# EAGLE schematic processor (EAGLE 9.0.0)

## Sheet 1 of 2
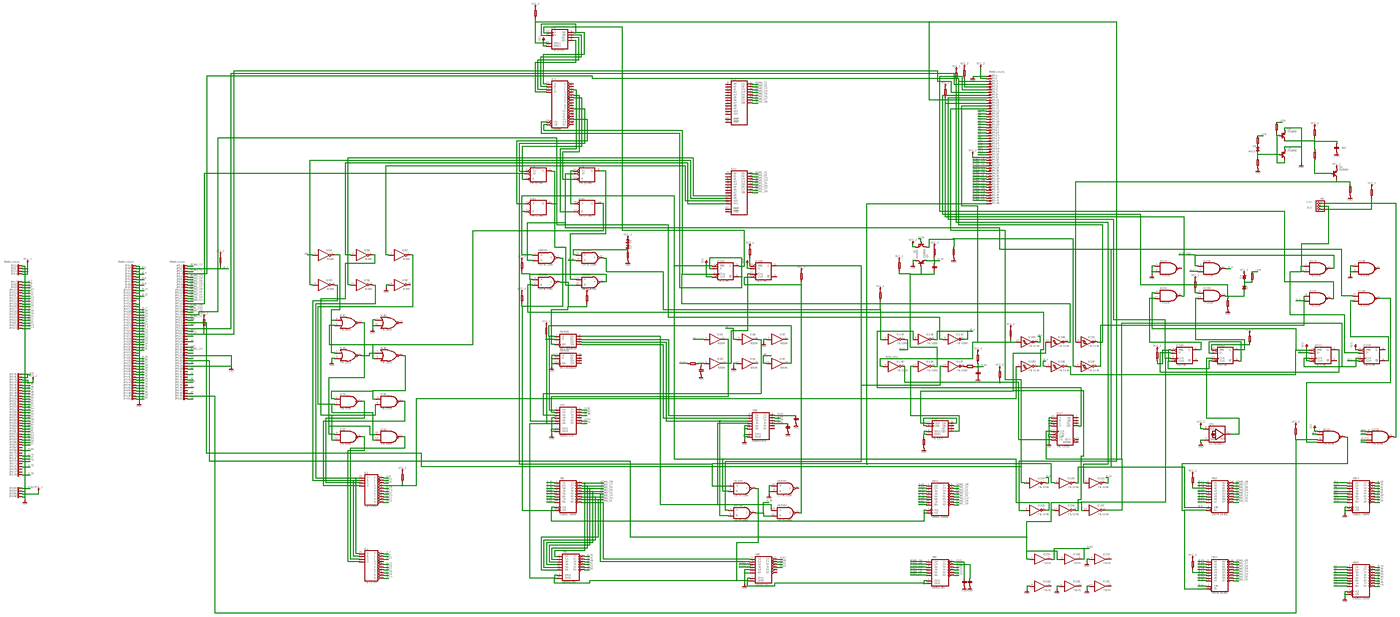
[diagram p0: schematic, sheet 1, overview]
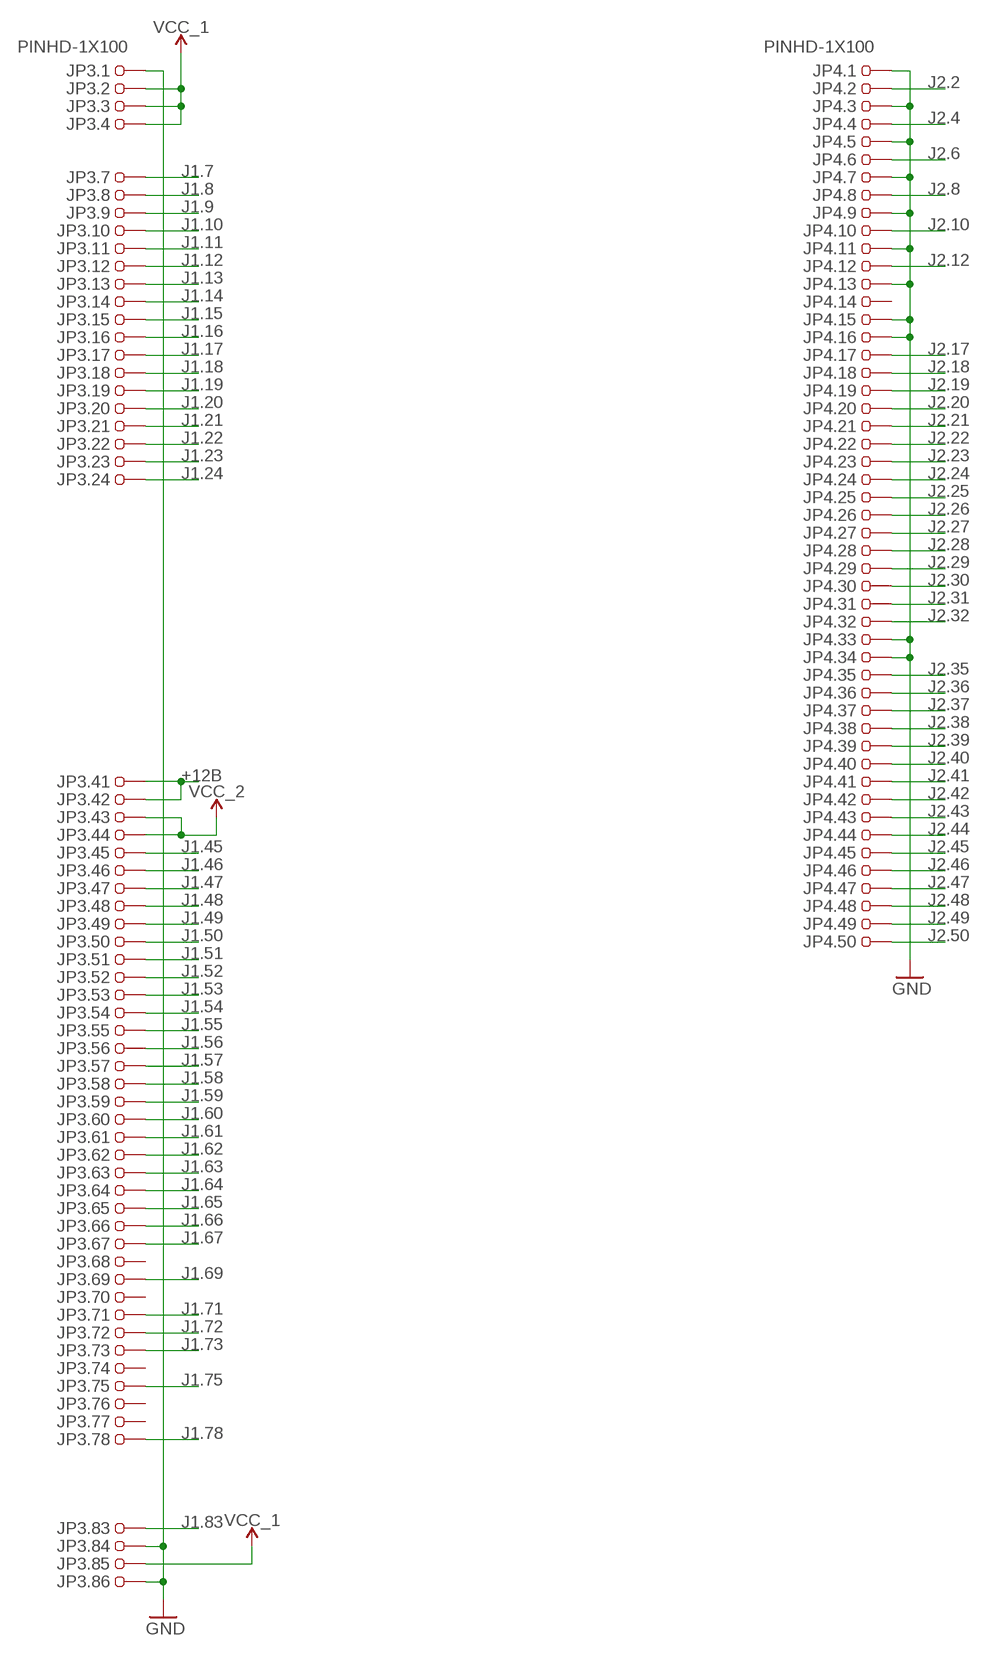
[diagram p1: schematic, sheet 1, part 1 of 6]
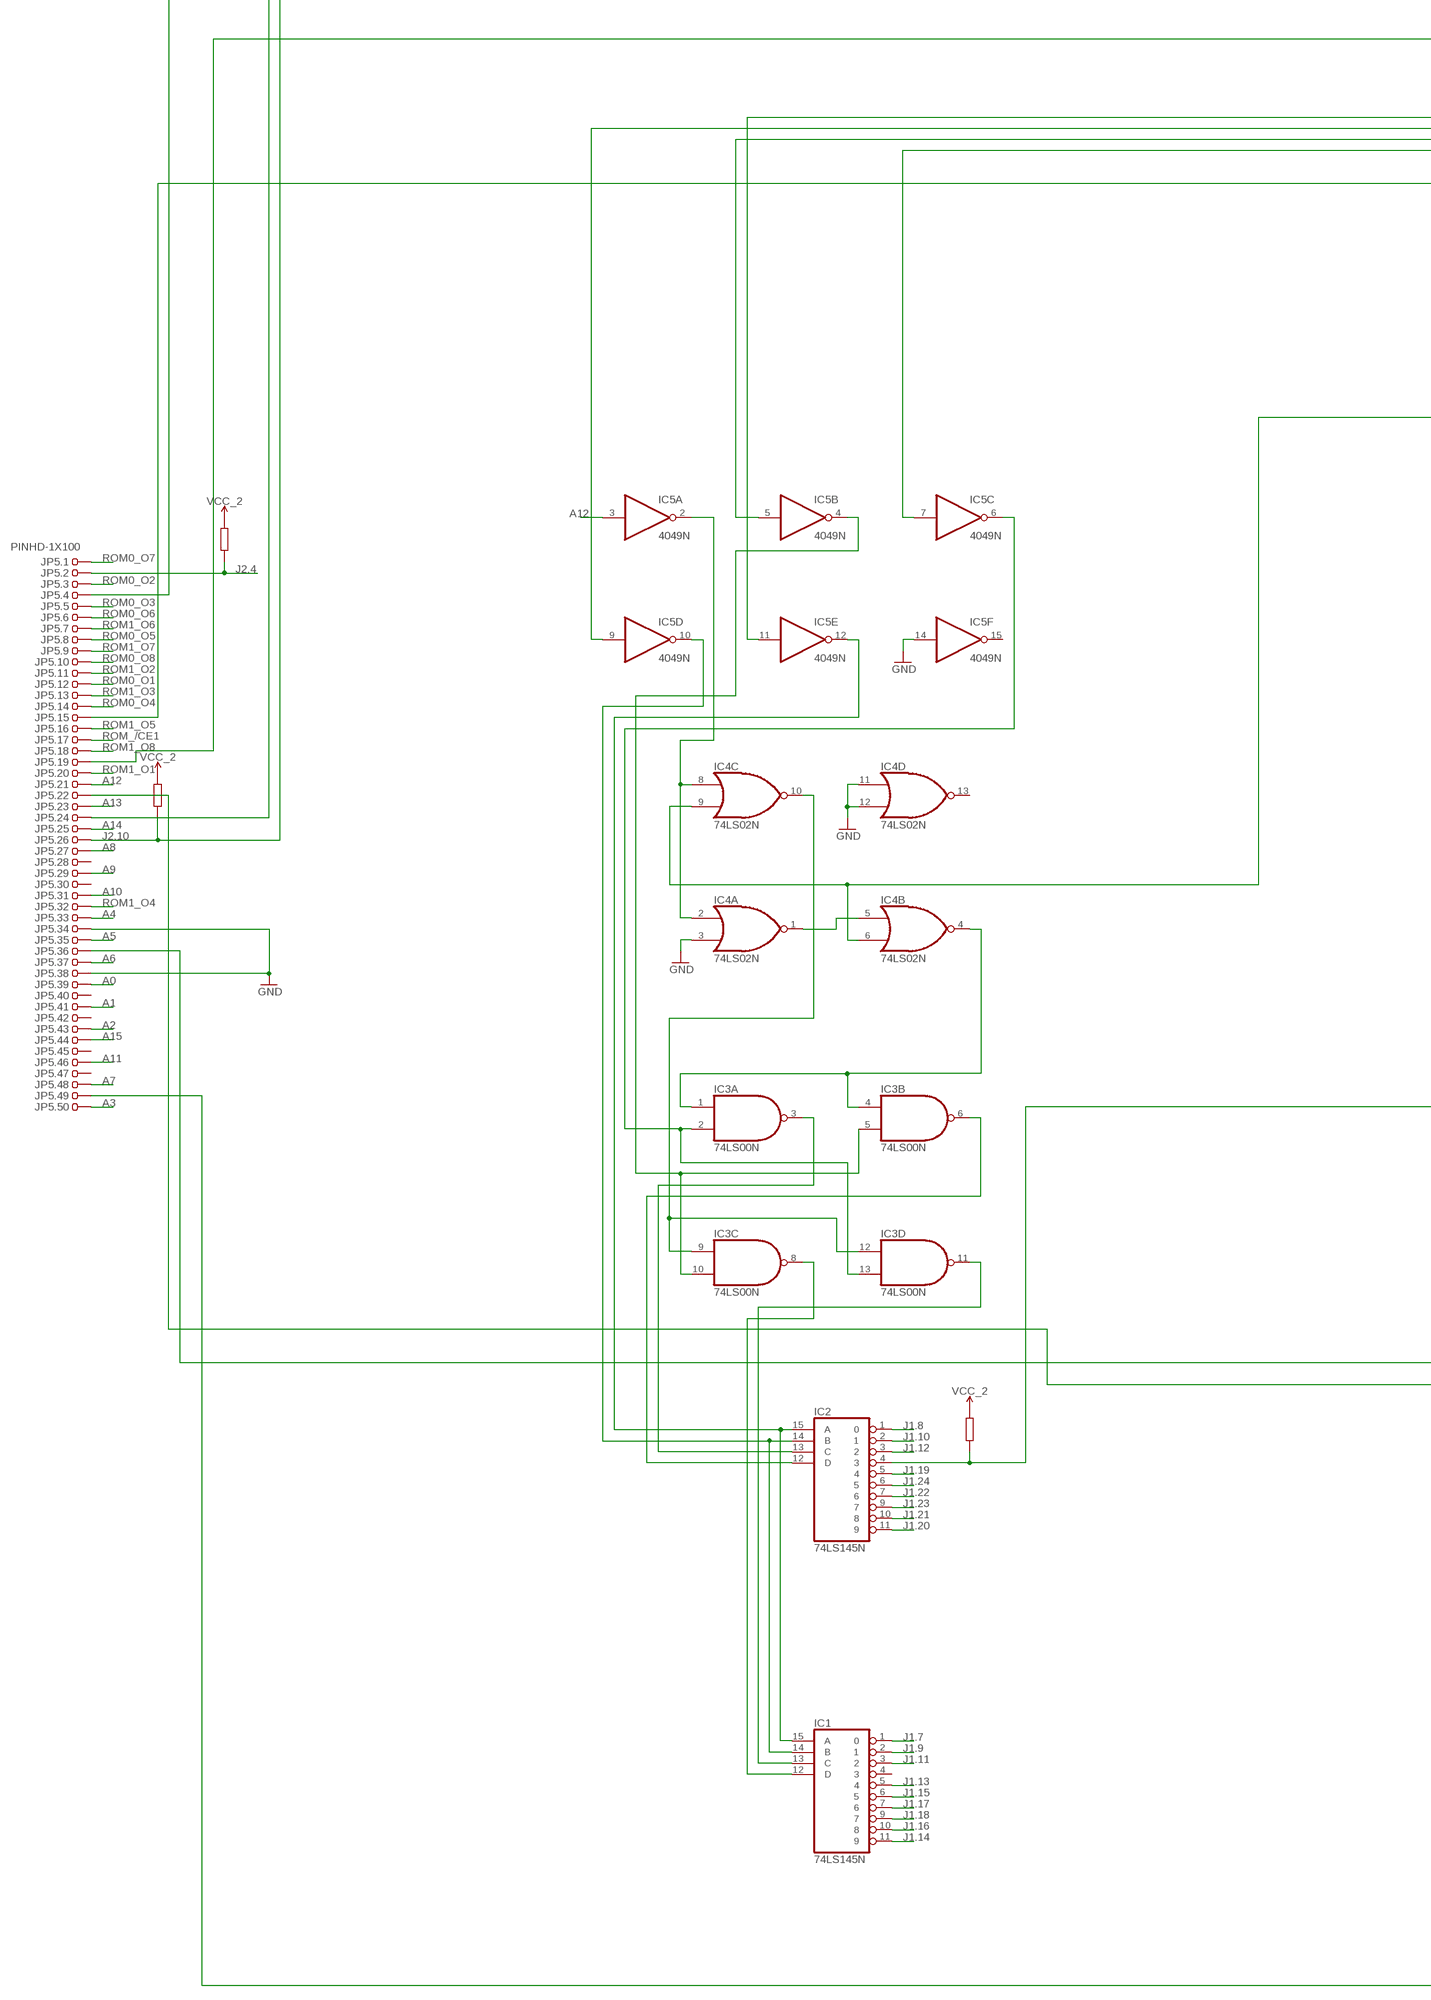
[diagram p2: schematic, sheet 1, part 2 of 6]
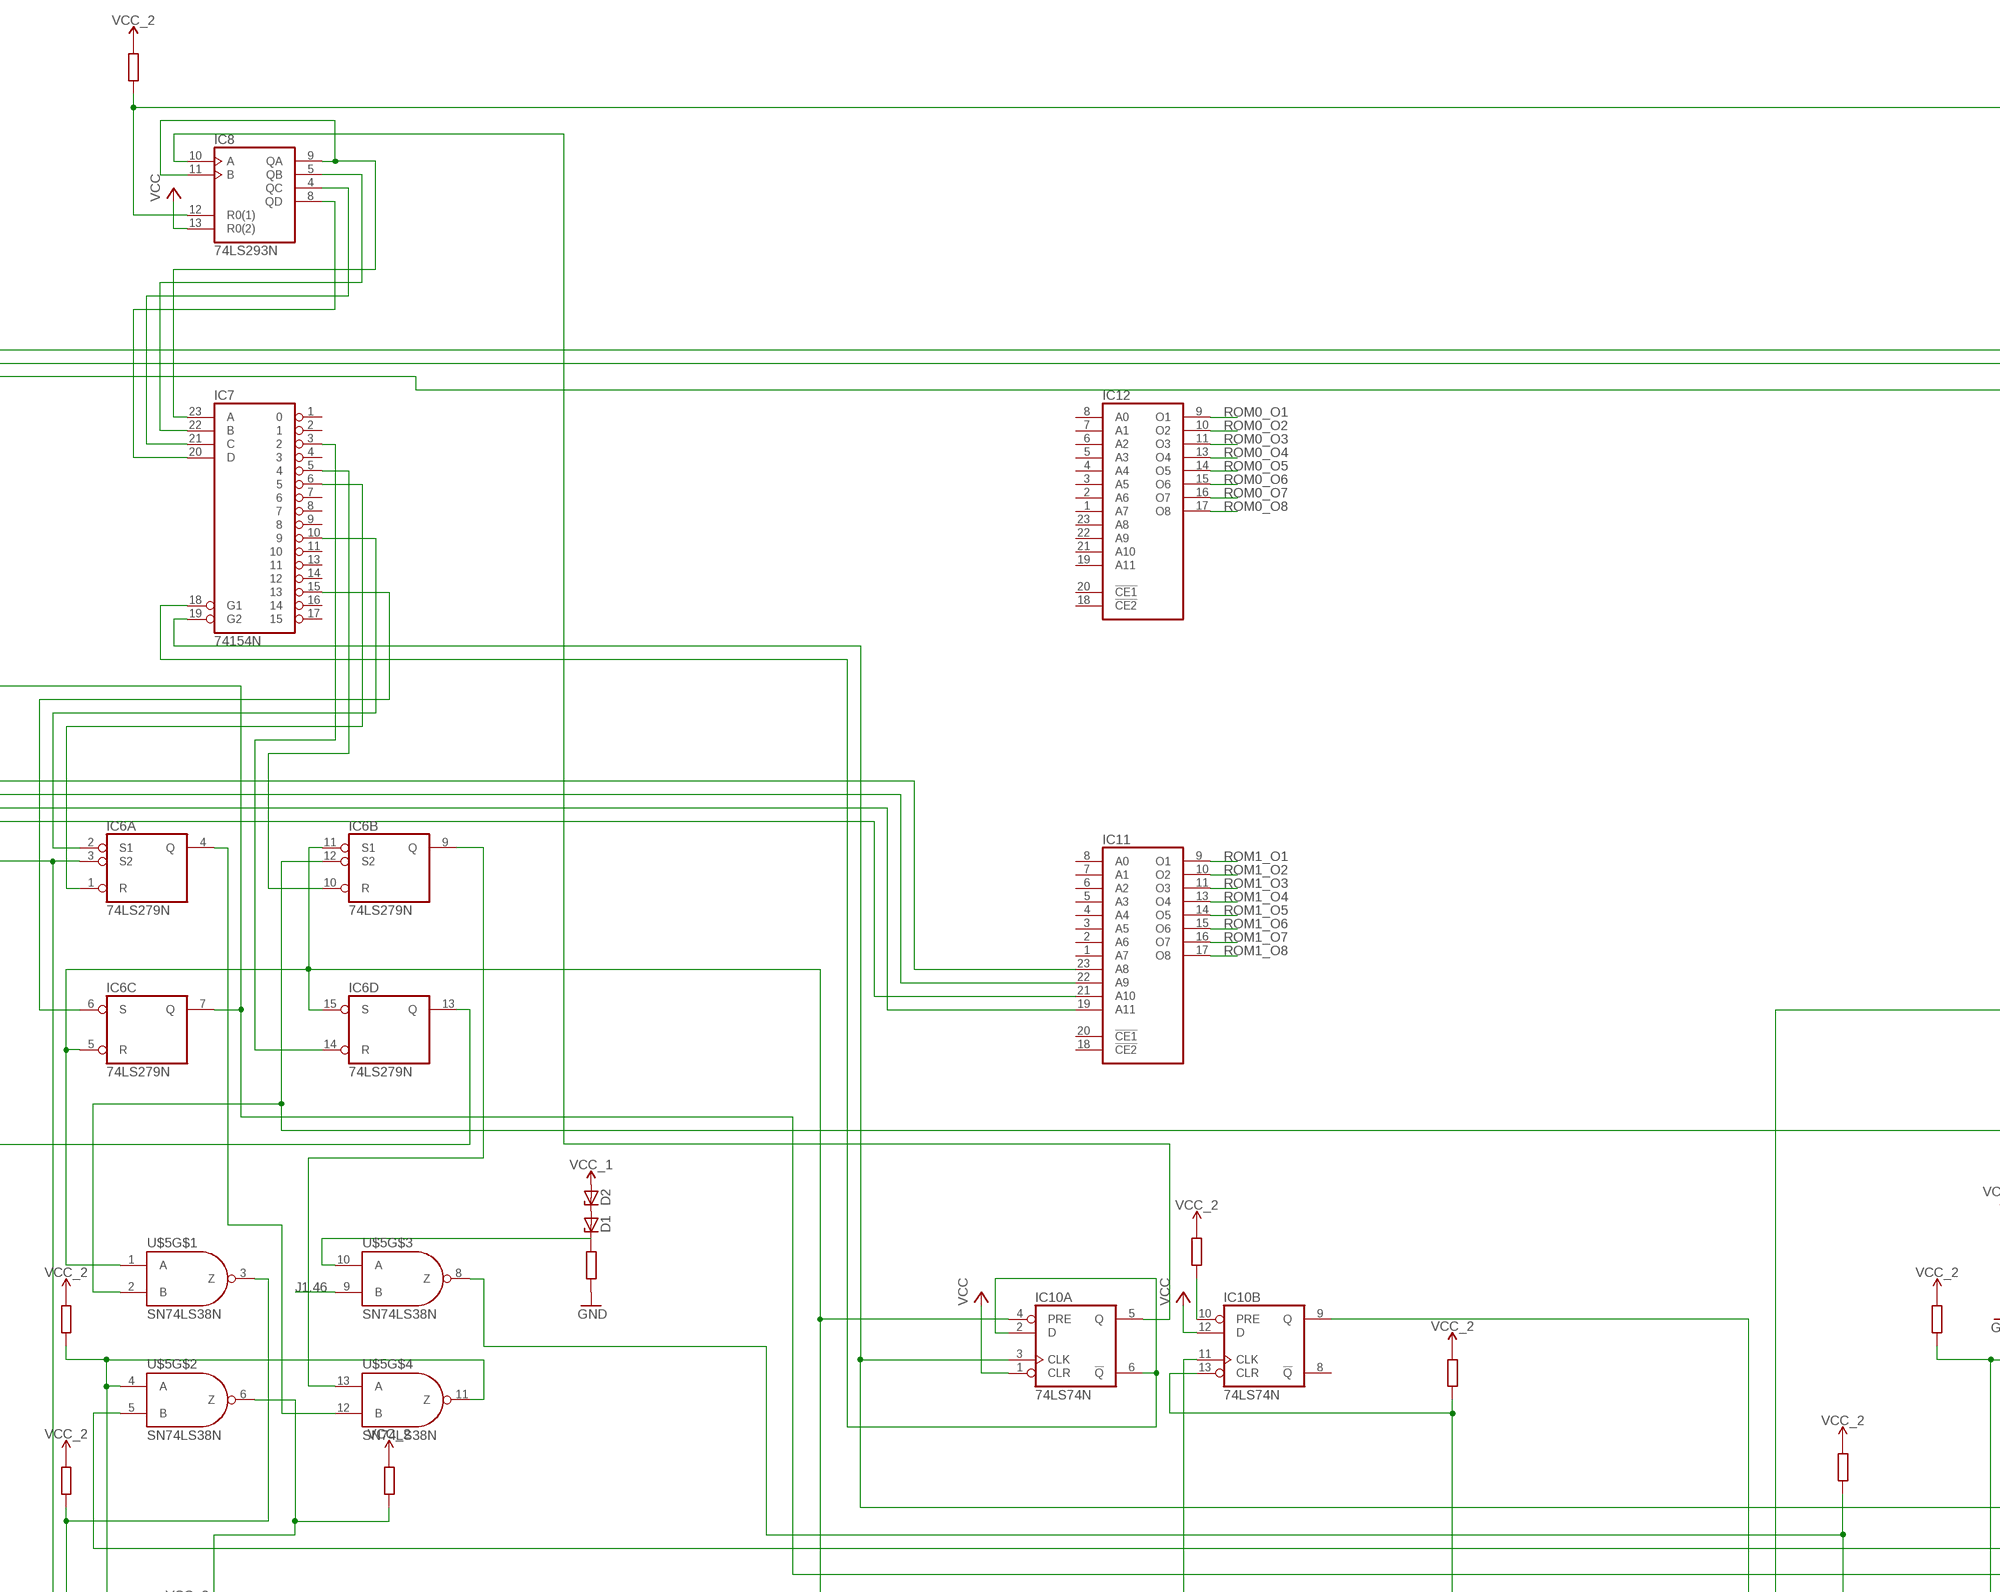
[diagram p3: schematic, sheet 1, part 3 of 6]
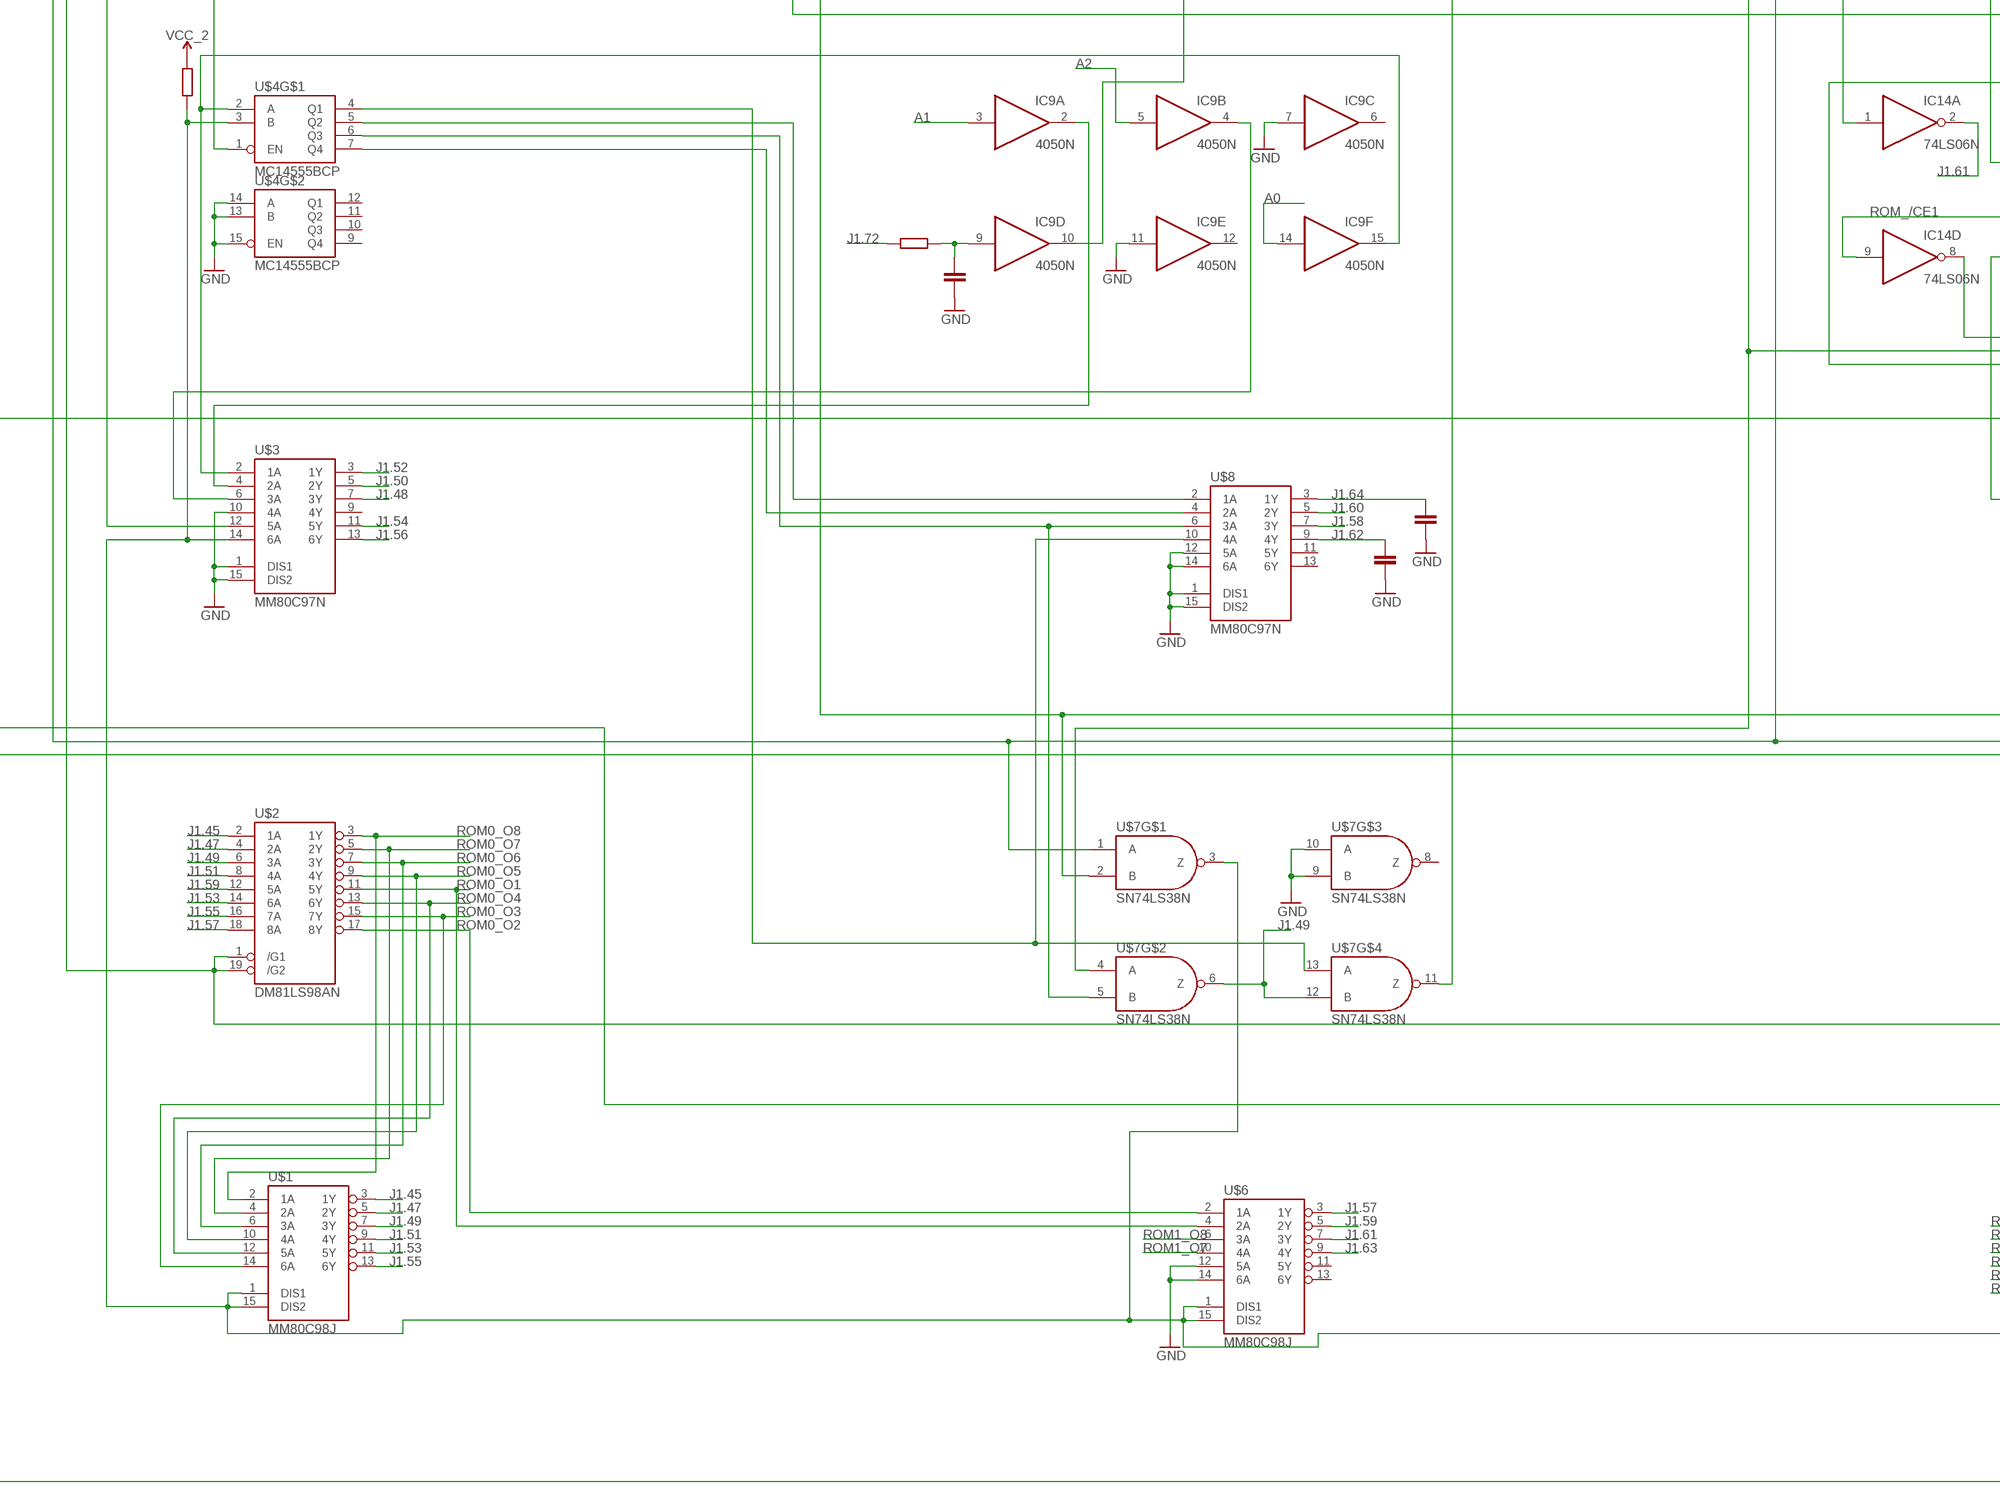
[diagram p4: schematic, sheet 1, part 4 of 6]
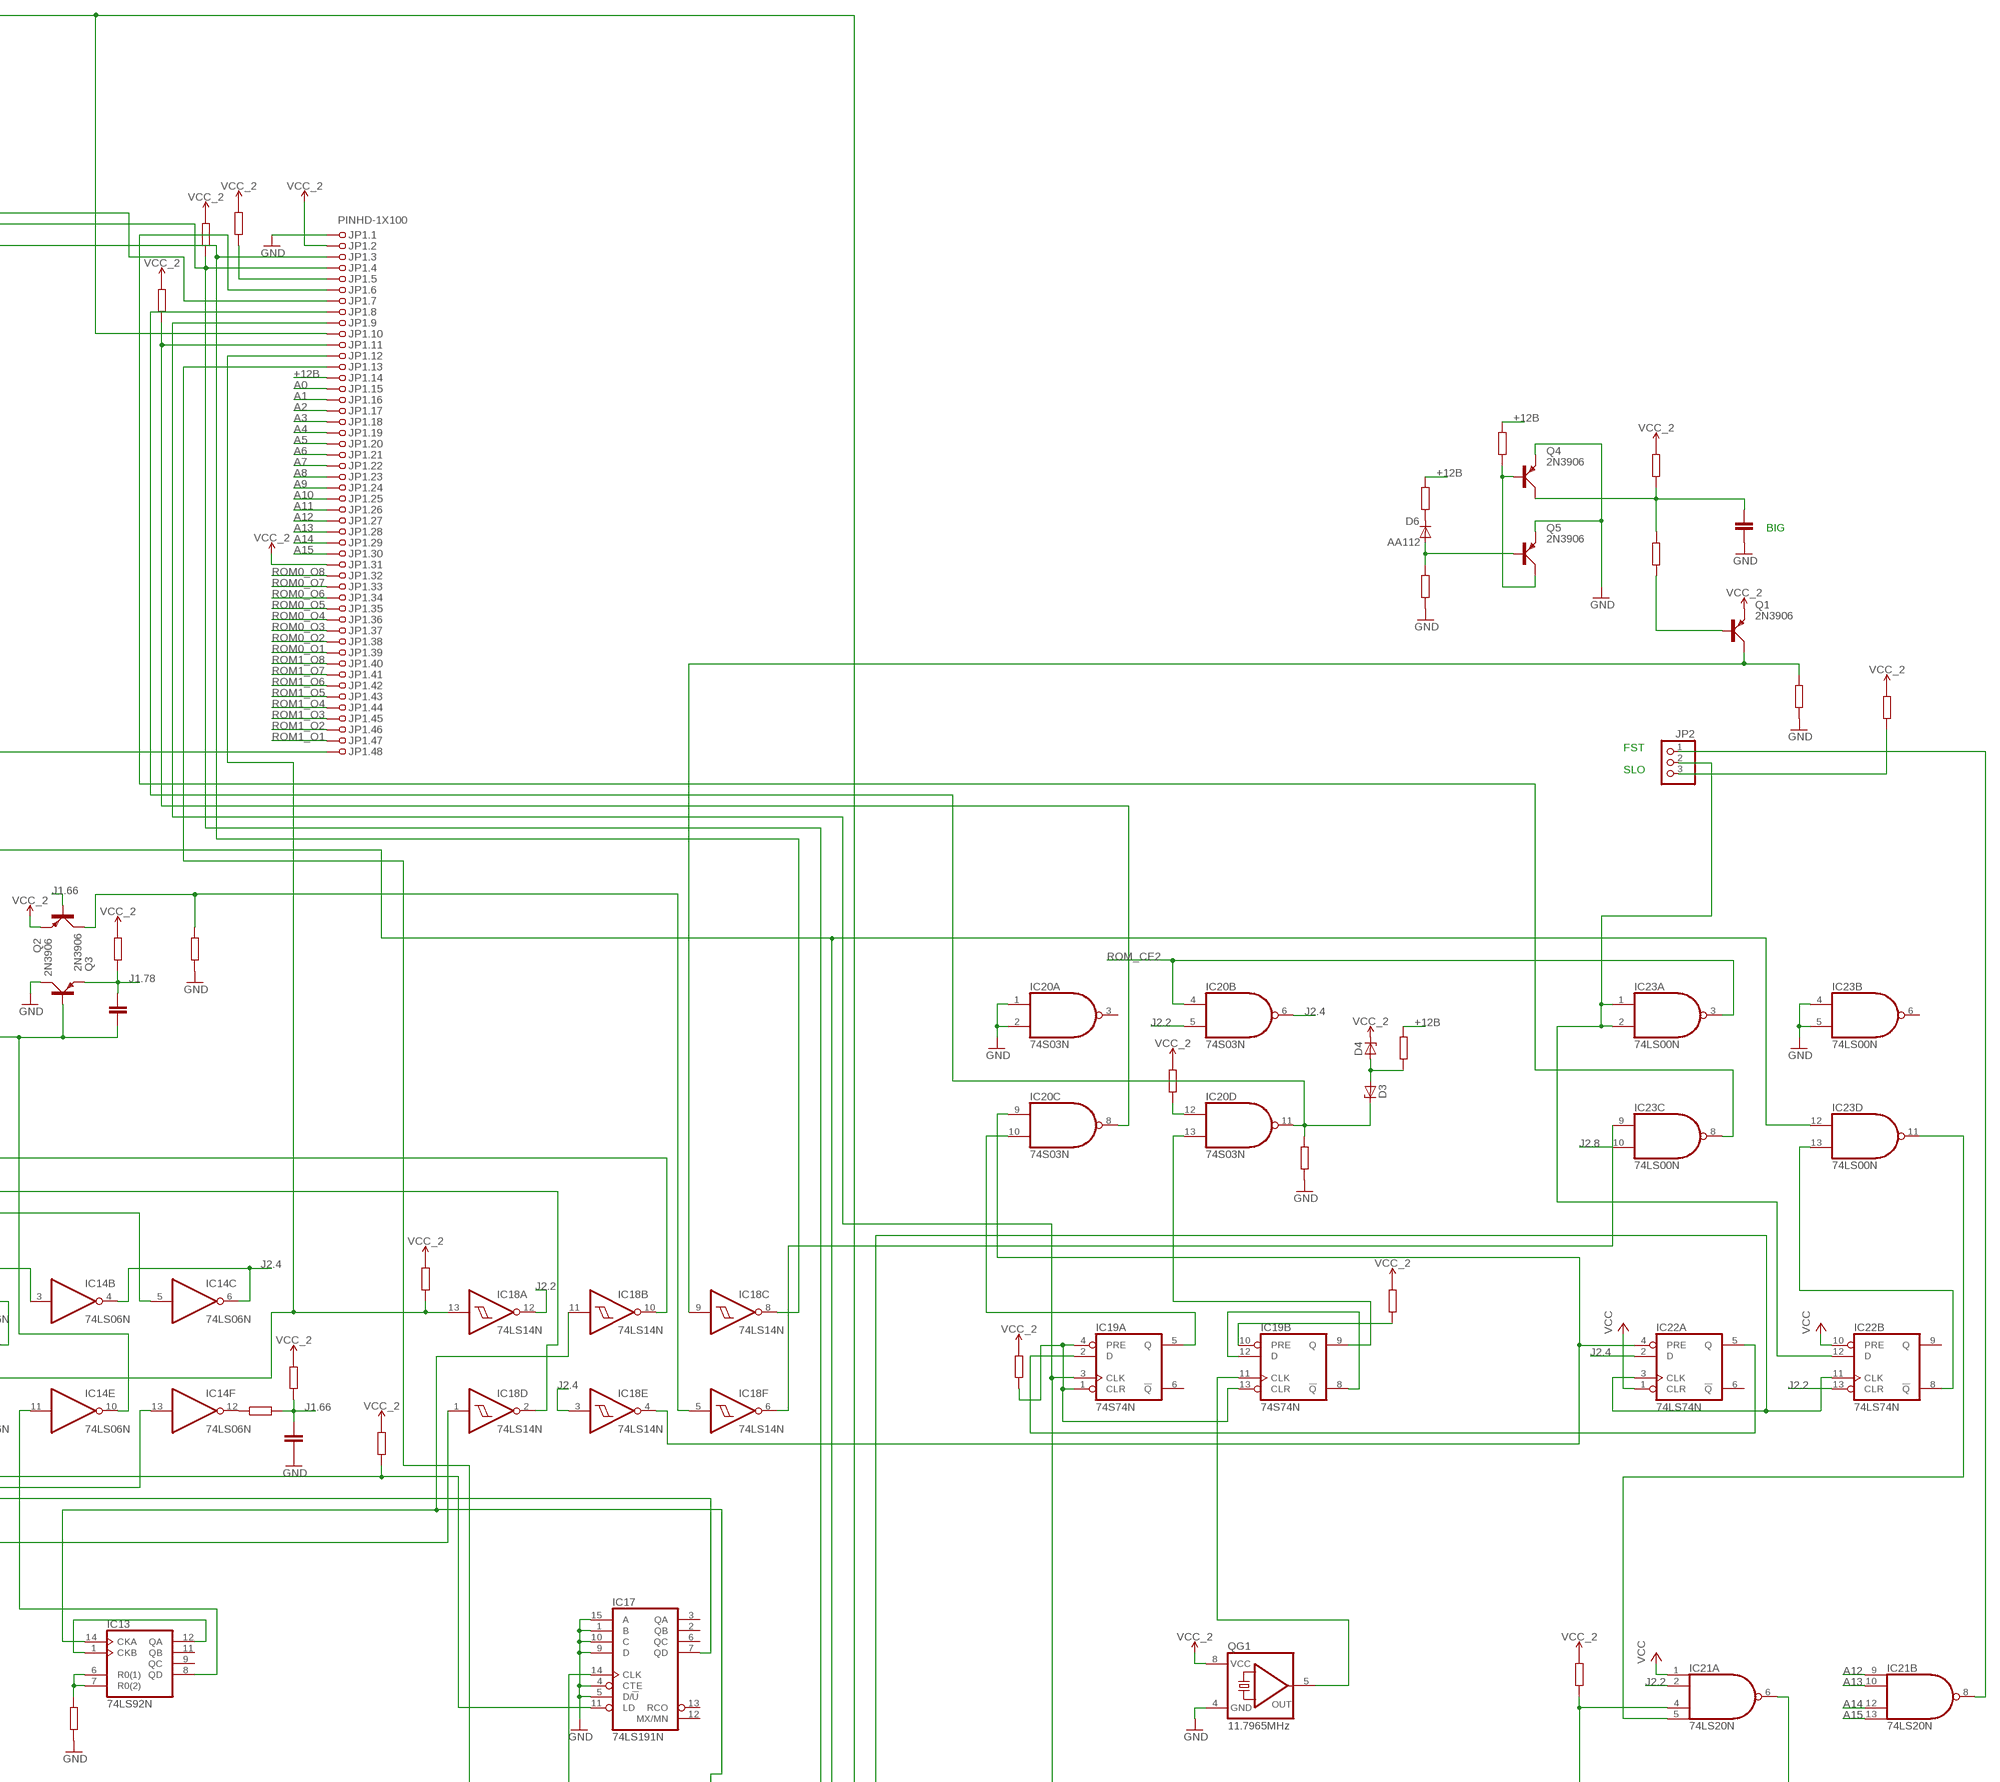
[diagram p5: schematic, sheet 1, part 5 of 6]
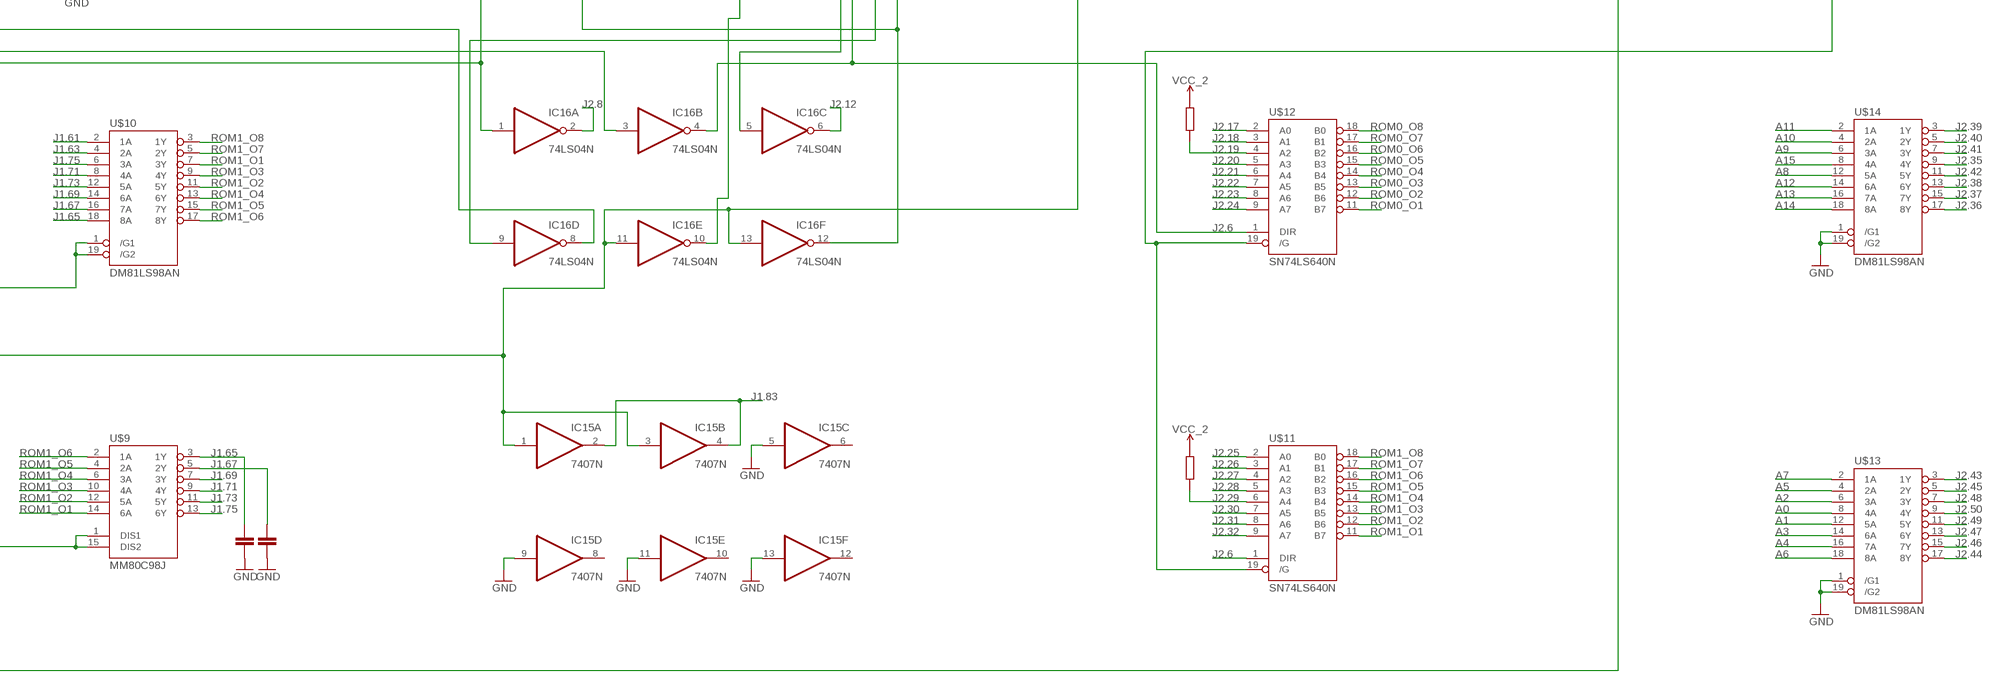
[diagram p6: schematic, sheet 1, part 6 of 6]

### Parts
D1  ZENER-DIODEC1702-15  [C1702-15]
D2  ZENER-DIODEC1702-15  [C1702-15]
D3  ZENER-DIODEC1702-15  [C1702-15]
D4  ZENER-DIODEC1702-15  [C1702-15]
D6  AA112  [DO07]
IC1  74LS145N  [DIL16]
IC2  74LS145N  [DIL16]
IC3  74LS00N  [DIL14]
IC4  74LS02N  [DIL14]
IC5  4049N  [DIL16]
IC6  74LS279N  [DIL16]
IC7  74154N  [DIL24-6]
IC8  74LS293N  [DIL14]
IC9  4050N  [DIL16]
IC10  74LS74N  [DIL14]
IC11  7142E  [DIL24]
IC12  7142E  [DIL24]
IC13  74LS92N  [DIL14]
IC14  74LS06N  [DIL14]
IC15  7407N  [DIL14]
IC16  74LS04N  [DIL14]
IC17  74LS191N  [DIL16]
IC18  74LS14N  [DIL14]
IC19  74S74N  [DIL14]
IC20  74S03N  [DIL14]
IC21  74LS20N  [DIL14]
IC22  74LS74N  [DIL14]
IC23  74LS00N  [DIL14]
JP1  PINHD-1X100  [1X100]
JP2  PINHD-1X3  [1X03]
JP3  PINHD-1X100  [1X100]
JP4  PINHD-1X100  [1X100]
JP5  PINHD-1X100  [1X100]
Q1  2N3906  [TO92D]
Q2  2N3906  [TO92D]
Q3  2N3906  [TO92D]
Q4  2N3906  [TO92D]
Q5  2N3906  [TO92D]
QG1  11.7965MHz  QG5460  [DIL08S]
U$1  MM80C98J  [DIL16]
U$2  DM81LS98AN  [DIL20]
U$3  MM80C97N  [DIL16]
U$4  MC14555BCP  [DIL16]
U$5  SN74LS38N  [DIL14]
U$6  MM80C98J  [DIL16]
U$7  SN74LS38N  [DIL14]
U$8  MM80C97N  [DIL16]
U$9  MM80C98J  [DIL16]
U$10  DM81LS98AN  [DIL20]
U$11  SN74LS640N  [DIL20]
U$12  SN74LS640N  [DIL20]
U$13  DM81LS98AN  [DIL20]
U$14  DM81LS98AN  [DIL20]

### Nets
+12B: D3.A D4.A JP1.14 JP3.41 JP3.42 ; also sheet 2
A0: IC9.14(F:I) JP1.15 JP5.39 U$13.8(4A) ; also sheet 2
A1: IC9.3(A:I) JP1.16 JP5.41 U$13.12(5A) ; also sheet 2
A2: IC9.5(B:I) JP1.17 JP5.43 U$13.6(3A) ; also sheet 2
A3: JP1.18 JP5.50 U$13.14(6A) ; also sheet 2
A4: JP1.19 JP5.33 U$13.16(7A) ; also sheet 2
A5: JP1.20 JP5.35 U$13.4(2A) ; also sheet 2
A6: JP1.21 JP5.37 U$13.18(8A) ; also sheet 2
A7: JP1.22 JP5.48 U$13.2(1A) ; also sheet 2
A8: JP1.23 JP5.27 U$14.12(5A) ; also sheet 2
A9: JP1.24 JP5.29 U$14.6(3A) ; also sheet 2
A10: JP1.25 JP5.31 U$14.4(2A) ; also sheet 2
A11: JP1.26 JP5.46 U$14.2(1A) ; also sheet 2
A12: IC5.3(A:I) IC21.9(B:I0) JP1.27 JP5.21 U$14.14(6A) ; also sheet 2
A13: IC21.10(B:I1) JP1.28 JP5.23 U$14.16(7A) ; also sheet 2
A14: IC21.12(B:I2) JP1.29 JP5.25 U$14.18(8A) ; also sheet 2
A15: IC21.13(B:I3) JP1.30 JP5.44 U$14.8(4A) ; also sheet 2
GND: IC4.3(A:I1) IC4.11(D:I0) IC4.12(D:I1) IC5.14(F:I) IC9.7(C:I) IC9.11(E:I) IC15.5(C:I) IC15.9(D:I) IC15.11(E:I) IC15.13(F:I) IC17.1(B) IC17.4(CTE) IC17.5(D/!U) IC17.9(D) IC17.10(C) IC17.15(A) IC20.1(A:I0) IC20.2(A:I1) IC23.4(B:I0) IC23.5(B:I1) JP1.1 JP3.1 JP3.84 JP3.86 JP4.1 JP4.3 JP4.5 JP4.7 JP4.9 JP4.11 JP4.13 JP4.15 JP4.16 JP4.33 JP4.34 JP5.34 JP5.38 Q3.C Q4.E Q5.E QG1.4(GND) U$3.1(DIS1) U$3.10(4A) U$3.15(DIS2) U$4.13(B) U$4.14(A) U$4.15(EN) U$6.12(5A) U$6.14(6A) U$7.9(B) U$7.10(A) U$8.1(DIS1) U$8.12(5A) U$8.14(6A) U$8.15(DIS2) U$13.1(/G1) U$13.19(/G2) U$14.1(/G1) U$14.19(/G2) ; also sheet 2
J1.7: IC1.1 JP3.7
J1.8: IC2.1 JP3.8
J1.9: IC1.2 JP3.9
J1.10: IC2.2 JP3.10
J1.11: IC1.3 JP3.11
J1.12: IC2.3 JP3.12
J1.13: IC1.5 JP3.13
J1.14: IC1.11 JP3.14
J1.15: IC1.6 JP3.15
J1.16: IC1.10 JP3.16
J1.17: IC1.7 JP3.17
J1.18: IC1.9 JP3.18
J1.19: IC2.5 JP3.19
J1.20: IC2.11 JP3.20
J1.21: IC2.10 JP3.21
J1.22: IC2.7 JP3.22
J1.23: IC2.9 JP3.23
J1.24: IC2.6 JP3.24
J1.45: JP3.45 U$1.3(1Y) U$2.2(1A)
J1.46: JP3.46 U$5.9(B) ; also sheet 2
J1.47: JP3.47 U$1.5(2Y) U$2.4(2A)
J1.48: JP3.48 U$3.7(3Y)
J1.49: JP3.49 U$1.7(3Y) U$2.6(3A) U$7.6(Z) U$7.12(B)
J1.50: JP3.50 U$3.5(2Y)
J1.51: JP3.51 U$1.9(4Y) U$2.8(4A)
J1.52: JP3.52 U$3.3(1Y)
J1.53: JP3.53 U$1.11(5Y) U$2.14(6A)
J1.54: JP3.54 U$3.11(5Y)
J1.55: JP3.55 U$1.13(6Y) U$2.16(7A)
J1.56: JP3.56 U$3.13(6Y)
J1.57: JP3.57 U$2.18(8A) U$6.3(1Y)
J1.58: JP3.58 U$8.7(3Y)
J1.59: JP3.59 U$2.12(5A) U$6.5(2Y)
J1.60: JP3.60 U$8.5(2Y)
J1.61: IC14.2(A:O) JP3.61 U$6.7(3Y) U$10.2(1A)
J1.62: JP3.62 U$8.9(4Y)
J1.63: JP3.63 U$6.9(4Y) U$10.4(2A)
J1.64: JP3.64 U$8.3(1Y)
J1.65: JP3.65 U$9.3(1Y) U$10.18(8A)
J1.66: JP3.66 Q2.B
J1.67: JP3.67 U$9.5(2Y) U$10.16(7A)
J1.69: JP3.69 U$9.7(3Y) U$10.14(6A)
J1.71: JP3.71 U$9.9(4Y) U$10.8(4A)
J1.72: JP3.72 ; also sheet 2
J1.73: JP3.73 U$9.11(5Y) U$10.12(5A)
J1.75: JP3.75 U$9.13(6Y) U$10.6(3A)
J1.78: JP3.78 Q3.E ; also sheet 2
J1.83: IC15.2(A:O) IC15.4(B:O) JP3.83
J2.2: IC18.12(A:O) IC20.5(B:I1) IC21.2(A:I1) IC22.13(B:CLR) JP4.2
J2.4: IC14.4(B:O) IC14.6(C:O) IC18.3(E:I) IC20.6(B:O) IC22.2(A:D) JP4.4 JP5.2
J2.6: IC6.12(B:S2) IC16.4(B:O) IC23.12(D:I0) JP4.6 U$5.2(B) U$11.1(DIR) U$12.1(DIR)
J2.8: IC16.2(A:O) IC23.10(C:I1) JP4.8
J2.10: JP1.7 JP4.10 JP5.26
J2.12: IC16.6(C:O) JP4.12 ; also sheet 2
J2.17: JP4.17 U$12.2(A0)
J2.18: JP4.18 U$12.3(A1)
J2.19: JP4.19 U$12.4(A2)
J2.20: JP4.20 U$12.5(A3)
J2.21: JP4.21 U$12.6(A4)
J2.22: JP4.22 U$12.7(A5)
J2.23: JP4.23 U$12.8(A6)
J2.24: JP4.24 U$12.9(A7)
J2.25: JP4.25 U$11.2(A0)
J2.26: JP4.26 U$11.3(A1)
J2.27: JP4.27 U$11.4(A2)
J2.28: JP4.28 U$11.5(A3)
J2.29: JP4.29 U$11.6(A4)
J2.30: JP4.30 U$11.7(A5)
J2.31: JP4.31 U$11.8(A6)
J2.32: JP4.32 U$11.9(A7)
J2.35: JP4.35 U$14.9(4Y)
J2.36: JP4.36 U$14.17(8Y)
J2.37: JP4.37 U$14.15(7Y)
J2.38: JP4.38 U$14.13(6Y)
J2.39: JP4.39 U$14.3(1Y)
J2.40: JP4.40 U$14.5(2Y)
J2.41: JP4.41 U$14.7(3Y)
J2.42: JP4.42 U$14.11(5Y)
J2.43: JP4.43 U$13.3(1Y)
J2.44: JP4.44 U$13.17(8Y)
J2.45: JP4.45 U$13.5(2Y)
J2.46: JP4.46 U$13.15(7Y)
J2.47: JP4.47 U$13.13(6Y)
J2.48: JP4.48 U$13.7(3Y)
J2.49: JP4.49 U$13.11(5Y)
J2.50: JP4.50 U$13.9(4Y)
N$1: IC3.1(A:I0) IC3.4(B:I0) IC4.4(B:O)
N$2: IC3.2(A:I1) IC3.13(D:I1) IC5.6(C:O)
N$3: IC3.5(B:I1) IC3.10(C:I1) IC5.4(B:O)
N$4: IC3.9(C:I0) IC3.12(D:I0) IC4.10(C:O)
N$5: IC4.1(A:O) IC4.5(B:I0)
N$6: IC4.2(A:I0) IC4.8(C:I0) IC5.2(A:O)
N$7: IC10.10(B:PRE)
N$8: IC9.10(D:O) IC10.11(B:CLK)
N$9: IC4.6(B:I1) IC4.9(C:I1) IC6.13(D:Q)
N$10: U$3.12(5A) U$5.4(A) U$5.11(Z)
N$11: IC6.5(C:R) IC6.11(B:S1) IC6.15(D:S) IC10.4(A:PRE) IC16.8(D:O) U$5.1(A) U$7.2(B)
N$12: IC10.13(B:CLR) U$7.11(Z)
N$13: IC7.23(A) IC8.9(QA) IC8.11(B)
N$14: IC18.5(F:I) Q2.C
N$15: IC14.3(B:I) IC17.7(QD)
N$16: U$2.1(/G1) U$2.19(/G2) U$5.3(Z) U$10.1(/G1) U$10.19(/G2)
N$17: IC19.1(A:CLR) IC19.4(A:PRE) IC19.13(B:CLR)
N$18: IC1.15(A) IC2.15(A) IC5.12(E:O)
N$20: IC1.14(B) IC2.14(B) IC5.10(D:O)
N$21: IC22.12(B:D) IC23.1(A:I0) IC23.2(A:I1) JP2.2
N$22: IC19.8(B:!Q) IC19.12(B:D)
N$23: IC9.9(D:I)
N$24: IC14.10(E:O) Q3.B
N$25: IC20.8(C:O) JP1.11
N$26: IC1.13(C) IC3.11(D:O)
N$27: IC1.12(D) IC3.8(C:O)
N$28: IC2.13(C) IC3.3(A:O)
N$29: IC2.12(D) IC3.6(B:O)
N$31: IC2.4 IC18.1(D:I)
N$32: IC5.5(B:I) IC11.19(A11)
N$33: IC5.7(C:I) IC11.21(A10)
N$34: IC7.21(C) IC8.4(QC)
N$35: IC5.11(E:I) IC11.23(A8)
N$36: IC5.9(D:I) IC11.22(A9)
N$38: IC7.22(B) IC8.5(QB)
N$39: IC7.20(D) IC8.8(QD)
N$40: IC8.12(R0(1)) IC16.9(D:I) JP1.10
N$41: IC7.19(G2) IC10.3(A:CLK) IC18.10(B:O)
N$42: IC8.10(A) IC10.5(A:Q)
N$43: IC6.14(D:R) IC7.3
N$44: IC6.10(B:R) IC7.5
N$45: IC6.1(A:R) IC7.6
N$46: IC6.2(A:S1) IC7.10
N$47: IC6.6(C:S) IC7.15
N$48: IC6.4(A:Q) U$5.12(B)
N$49: IC7.18(G1) IC10.2(A:D) IC10.6(A:!Q)
N$50: IC6.3(A:S2) IC16.3(B:I) JP1.48 JP5.15 U$7.1(A)
N$51: IC6.7(C:Q) IC14.5(C:I) JP5.19
N$52: D1.C U$5.10(A)
N$53: IC6.9(B:Q) U$5.13(A)
N$54: IC9.15(F:O) U$3.2(1A) U$4.2(A)
N$55: IC10.9(B:Q) IC14.13(F:I) U$7.4(A)
N$56: U$4.4(Q1) U$7.13(A) U$8.10(4A)
N$57: IC18.2(D:O) U$5.5(B)
N$58: U$4.1(EN) U$5.6(Z)
N$59: U$4.5(Q2) U$8.2(1A)
N$60: IC14.1(A:I) U$5.8(Z)
N$61: U$4.6(Q3) U$7.5(B) U$8.6(3A)
N$62: D1.A D2.C
N$63: U$4.7(Q4) U$8.4(2A)
N$64: IC9.2(A:O) U$3.4(2A)
N$65: IC9.4(B:O) U$3.6(3A)
N$66: IC14.8(D:O) IC17.11(LD)
N$67: U$1.1(DIS1) U$1.15(DIS2) U$3.14(6A) U$4.3(B) U$6.1(DIS1) U$6.15(DIS2) U$7.3(Z) U$9.1(DIS1) U$9.15(DIS2)
N$69: IC13.8(QD) IC14.11(E:I)
N$70: IC13.6(R0(1)) IC13.7(R0(2))
N$71: IC13.14(CKA) IC16.10(E:O) IC18.11(B:I)
N$72: IC18.4(E:O) IC20.9(C:I0) IC22.4(A:PRE)
N$73: IC13.1(CKB) IC13.12(QA)
N$74: IC18.8(C:O) JP1.3 JP5.4
N$75: IC18.6(F:O) IC23.9(C:I0)
N$76: IC18.9(C:I) Q1.C
N$77: IC16.5(C:I) JP1.4 JP5.24
N$78: IC16.12(F:O) IC17.14(CLK) IC22.3(A:CLK) IC22.11(B:CLK)
N$79: IC16.1(A:I) JP1.13 JP5.22
N$80: D3.C IC20.11(D:O) JP1.8
N$81: IC20.12(D:I0)
N$82: IC19.5(A:Q) IC20.10(C:I1)
N$83: IC19.9(B:Q) IC20.13(D:I1)
N$84: IC21.6(A:O) U$11.19(/G) U$12.19(/G)
N$85: IC19.2(A:D) IC22.5(A:Q)
N$86: IC19.10(B:PRE)
N$87: IC19.11(B:CLK) QG1.5(OUT)
N$88: IC21.8(B:O) JP2.1
N$89: Q1.B
N$90: Q4.C
N$91: JP2.3
N$92: Q4.B Q5.C
N$94: D6.A Q5.B
N$96: IC23.8(C:O) JP1.6
N$97: IC22.8(B:!Q) IC23.13(D:I1)
N$98: JP1.5
N$99: IC21.4(A:I2) JP5.49
N$110: IC21.5(A:I3) IC23.11(D:O)
N$999: IC15.1(A:I) IC15.3(B:I) IC16.11(E:I) IC16.13(F:I) IC19.3(A:CLK) JP1.9 JP5.36
ROM0_O1: IC12.9(O1) JP1.39 JP5.12 U$2.11(5Y) U$6.4(2A) U$12.11(B7)
ROM0_O2: IC12.10(O2) JP1.38 JP5.3 U$2.17(8Y) U$6.2(1A) U$12.12(B6)
ROM0_O3: IC12.11(O3) JP1.37 JP5.5 U$1.14(6A) U$2.15(7Y) U$12.13(B5)
ROM0_O4: IC12.13(O4) JP1.36 JP5.14 U$1.12(5A) U$2.13(6Y) U$12.14(B4)
ROM0_O5: IC12.14(O5) JP1.35 JP5.8 U$1.10(4A) U$2.9(4Y) U$12.15(B3)
ROM0_O6: IC12.15(O6) JP1.34 JP5.6 U$1.6(3A) U$2.7(3Y) U$12.16(B2)
ROM0_O7: IC12.16(O7) JP1.33 JP5.1 U$1.4(2A) U$2.5(2Y) U$12.17(B1)
ROM0_O8: IC12.17(O8) JP1.32 JP5.10 U$1.2(1A) U$2.3(1Y) U$12.18(B0)
ROM1_O1: IC11.9(O1) JP1.47 JP5.20 U$9.14(6A) U$10.7(3Y) U$11.11(B7)
ROM1_O2: IC11.10(O2) JP1.46 JP5.11 U$9.12(5A) U$10.11(5Y) U$11.12(B6)
ROM1_O3: IC11.11(O3) JP1.45 JP5.13 U$9.10(4A) U$10.9(4Y) U$11.13(B5)
ROM1_O4: IC11.13(O4) JP1.44 JP5.32 U$9.6(3A) U$10.13(6Y) U$11.14(B4)
ROM1_O5: IC11.14(O5) JP1.43 JP5.16 U$9.4(2A) U$10.15(7Y) U$11.15(B3)
ROM1_O6: IC11.15(O6) JP1.42 JP5.7 U$9.2(1A) U$10.17(8Y) U$11.16(B2)
ROM1_O7: IC11.16(O7) JP1.41 JP5.9 U$6.10(4A) U$10.5(2Y) U$11.17(B1)
ROM1_O8: IC11.17(O8) JP1.40 JP5.18 U$6.6(3A) U$10.3(1Y) U$11.18(B0)
ROM_/CE1: IC14.9(D:I) IC18.13(A:I) JP1.12 JP5.17
ROM_CE2: IC20.4(B:I0) IC23.3(A:O) ; also sheet 2
VCC: IC8.13(R0(2)) IC10.1(A:CLR) IC10.12(B:D) IC21.1(A:I0) IC22.1(A:CLR) IC22.10(B:PRE) ; also sheet 2
VCC_1: D2.A JP3.2 JP3.3 JP3.4 JP3.85 ; also sheet 2
VCC_2: D4.C JP1.2 JP1.31 JP3.43 JP3.44 Q1.E Q2.E QG1.8(VCC) ; also sheet 2
Unconnected: D6.C IC1.4 IC4.13(D:O) IC5.15(F:O) IC7.1 IC7.2 IC7.4 IC7.7 IC7.8 IC7.9 IC7.11 IC7.13 IC7.14 IC7.16 IC7.17 IC9.6(C:O) IC9.12(E:O) IC10.8(B:!Q) IC11.1(A7) IC11.2(A6) IC11.3(A5) IC11.4(A4) IC11.5(A3) IC11.6(A2) IC11.7(A1) IC11.8(A0) IC11.18(!CE2) IC11.20(!CE1) IC12.1(A7) IC12.2(A6) IC12.3(A5) IC12.4(A4) IC12.5(A3) IC12.6(A2) IC12.7(A1) IC12.8(A0) IC12.18(!CE2) IC12.19(A11) IC12.20(!CE1) IC12.21(A10) IC12.22(A9) IC12.23(A8) IC13.9(QC) IC13.11(QB) IC14.12(F:O) IC15.6(C:O) IC15.8(D:O) IC15.10(E:O) IC15.12(F:O) IC17.2(QB) IC17.3(QA) IC17.6(QC) IC17.12(MX/MN) IC17.13(RCO) IC19.6(A:!Q) IC20.3(A:O) IC22.6(A:!Q) IC22.9(B:Q) IC23.6(B:O) JP1.49 JP1.50 JP1.51 JP1.52 JP1.53 JP1.54 JP1.55 JP1.56 JP1.57 JP1.58 JP1.59 JP1.60 JP1.61 JP1.62 JP1.63 JP1.64 JP1.65 JP1.66 JP1.67 JP1.68 JP1.69 JP1.70 JP1.71 JP1.72 JP1.73 JP1.74 JP1.75 JP1.76 JP1.77 JP1.78 JP1.79 JP1.80 JP1.81 JP1.82 JP1.83 JP1.84 JP1.85 JP1.86 JP1.87 JP1.88 JP1.89 JP1.90 JP1.91 JP1.92 JP1.93 JP1.94 JP1.95 JP1.96 JP1.97 JP1.98 JP1.99 JP1.100 JP3.5 JP3.6 JP3.25 JP3.26 JP3.27 JP3.28 JP3.29 JP3.30 JP3.31 JP3.32 JP3.33 JP3.34 JP3.35 JP3.36 JP3.37 JP3.38 JP3.39 JP3.40 JP3.68 JP3.70 JP3.74 JP3.76 JP3.77 JP3.79 JP3.80 JP3.81 JP3.82 JP3.87 JP3.88 JP3.89 JP3.90 JP3.91 JP3.92 JP3.93 JP3.94 JP3.95 JP3.96 JP3.97 JP3.98 JP3.99 JP3.100 JP4.14 JP4.51 JP4.52 JP4.53 JP4.54 JP4.55 JP4.56 JP4.57 JP4.58 JP4.59 JP4.60 JP4.61 JP4.62 JP4.63 JP4.64 JP4.65 JP4.66 JP4.67 JP4.68 JP4.69 JP4.70 JP4.71 JP4.72 JP4.73 JP4.74 JP4.75 JP4.76 JP4.77 JP4.78 JP4.79 JP4.80 JP4.81 JP4.82 JP4.83 JP4.84 JP4.85 JP4.86 JP4.87 JP4.88 JP4.89 JP4.90 JP4.91 JP4.92 JP4.93 JP4.94 JP4.95 JP4.96 JP4.97 JP4.98 JP4.99 JP4.100 JP5.28 JP5.30 JP5.40 JP5.42 JP5.45 JP5.47 JP5.51 JP5.52 JP5.53 JP5.54 JP5.55 JP5.56 JP5.57 JP5.58 JP5.59 JP5.60 JP5.61 JP5.62 JP5.63 JP5.64 JP5.65 JP5.66 JP5.67 JP5.68 JP5.69 JP5.70 JP5.71 JP5.72 JP5.73 JP5.74 JP5.75 JP5.76 JP5.77 JP5.78 JP5.79 JP5.80 JP5.81 JP5.82 JP5.83 JP5.84 JP5.85 JP5.86 JP5.87 JP5.88 JP5.89 JP5.90 JP5.91 JP5.92 JP5.93 JP5.94 JP5.95 JP5.96 JP5.97 JP5.98 JP5.99 JP5.100 U$3.9(4Y) U$4.9(Q4) U$4.10(Q3) U$4.11(Q2) U$4.12(Q1) U$6.11(5Y) U$6.13(6Y) U$7.8(Z) U$8.11(5Y) U$8.13(6Y)

### Notes on the sheet
- BIG
- FST
- SLO

## Sheet 2 of 2
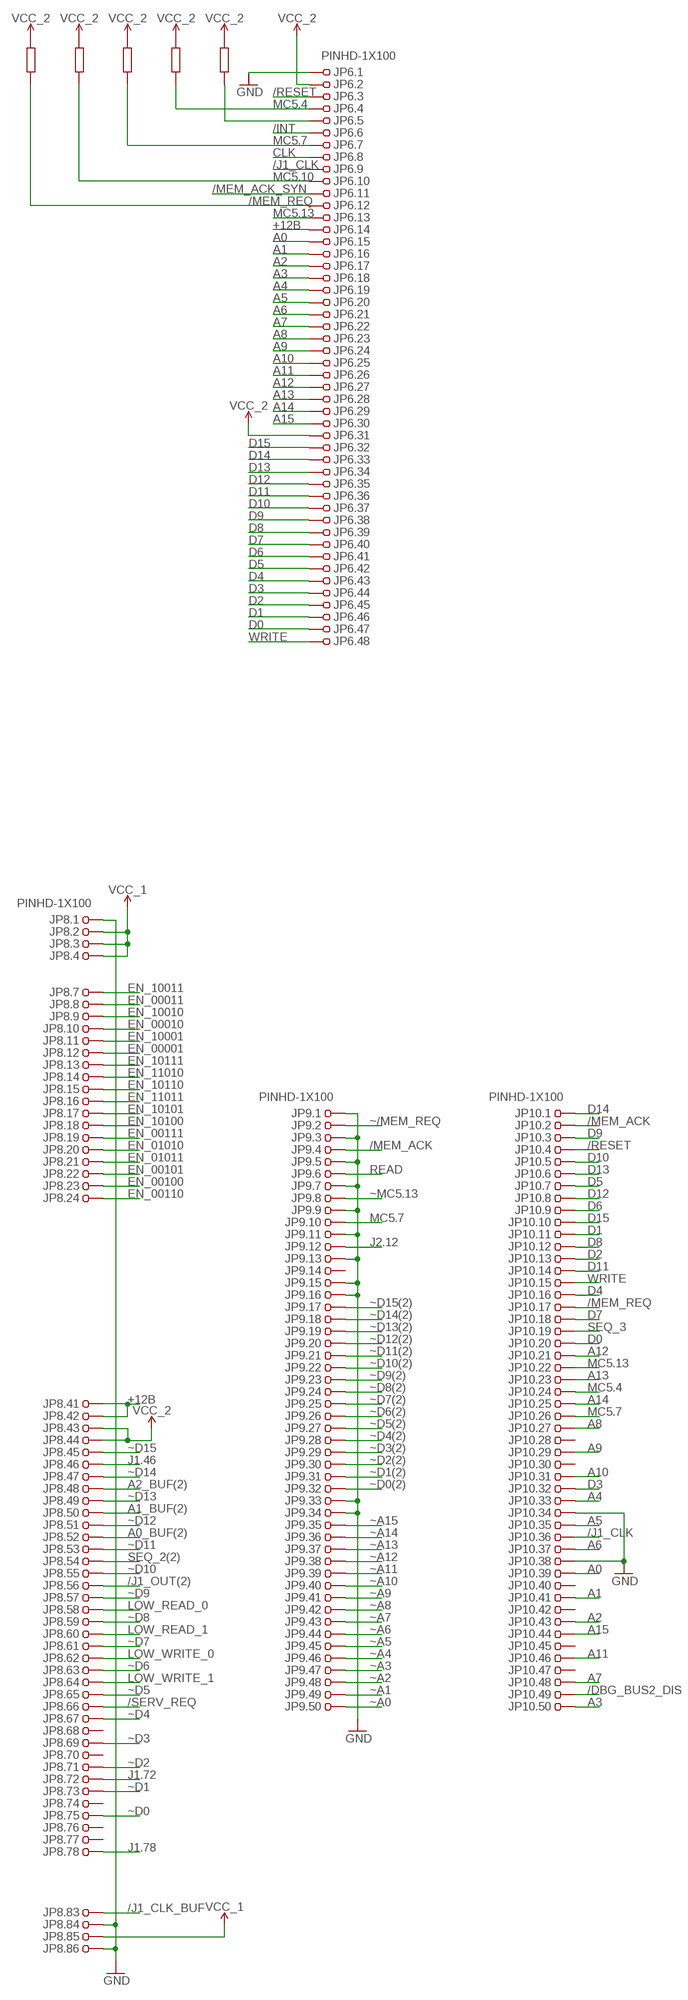
[diagram p7: schematic, sheet 2, part 1 of 3]
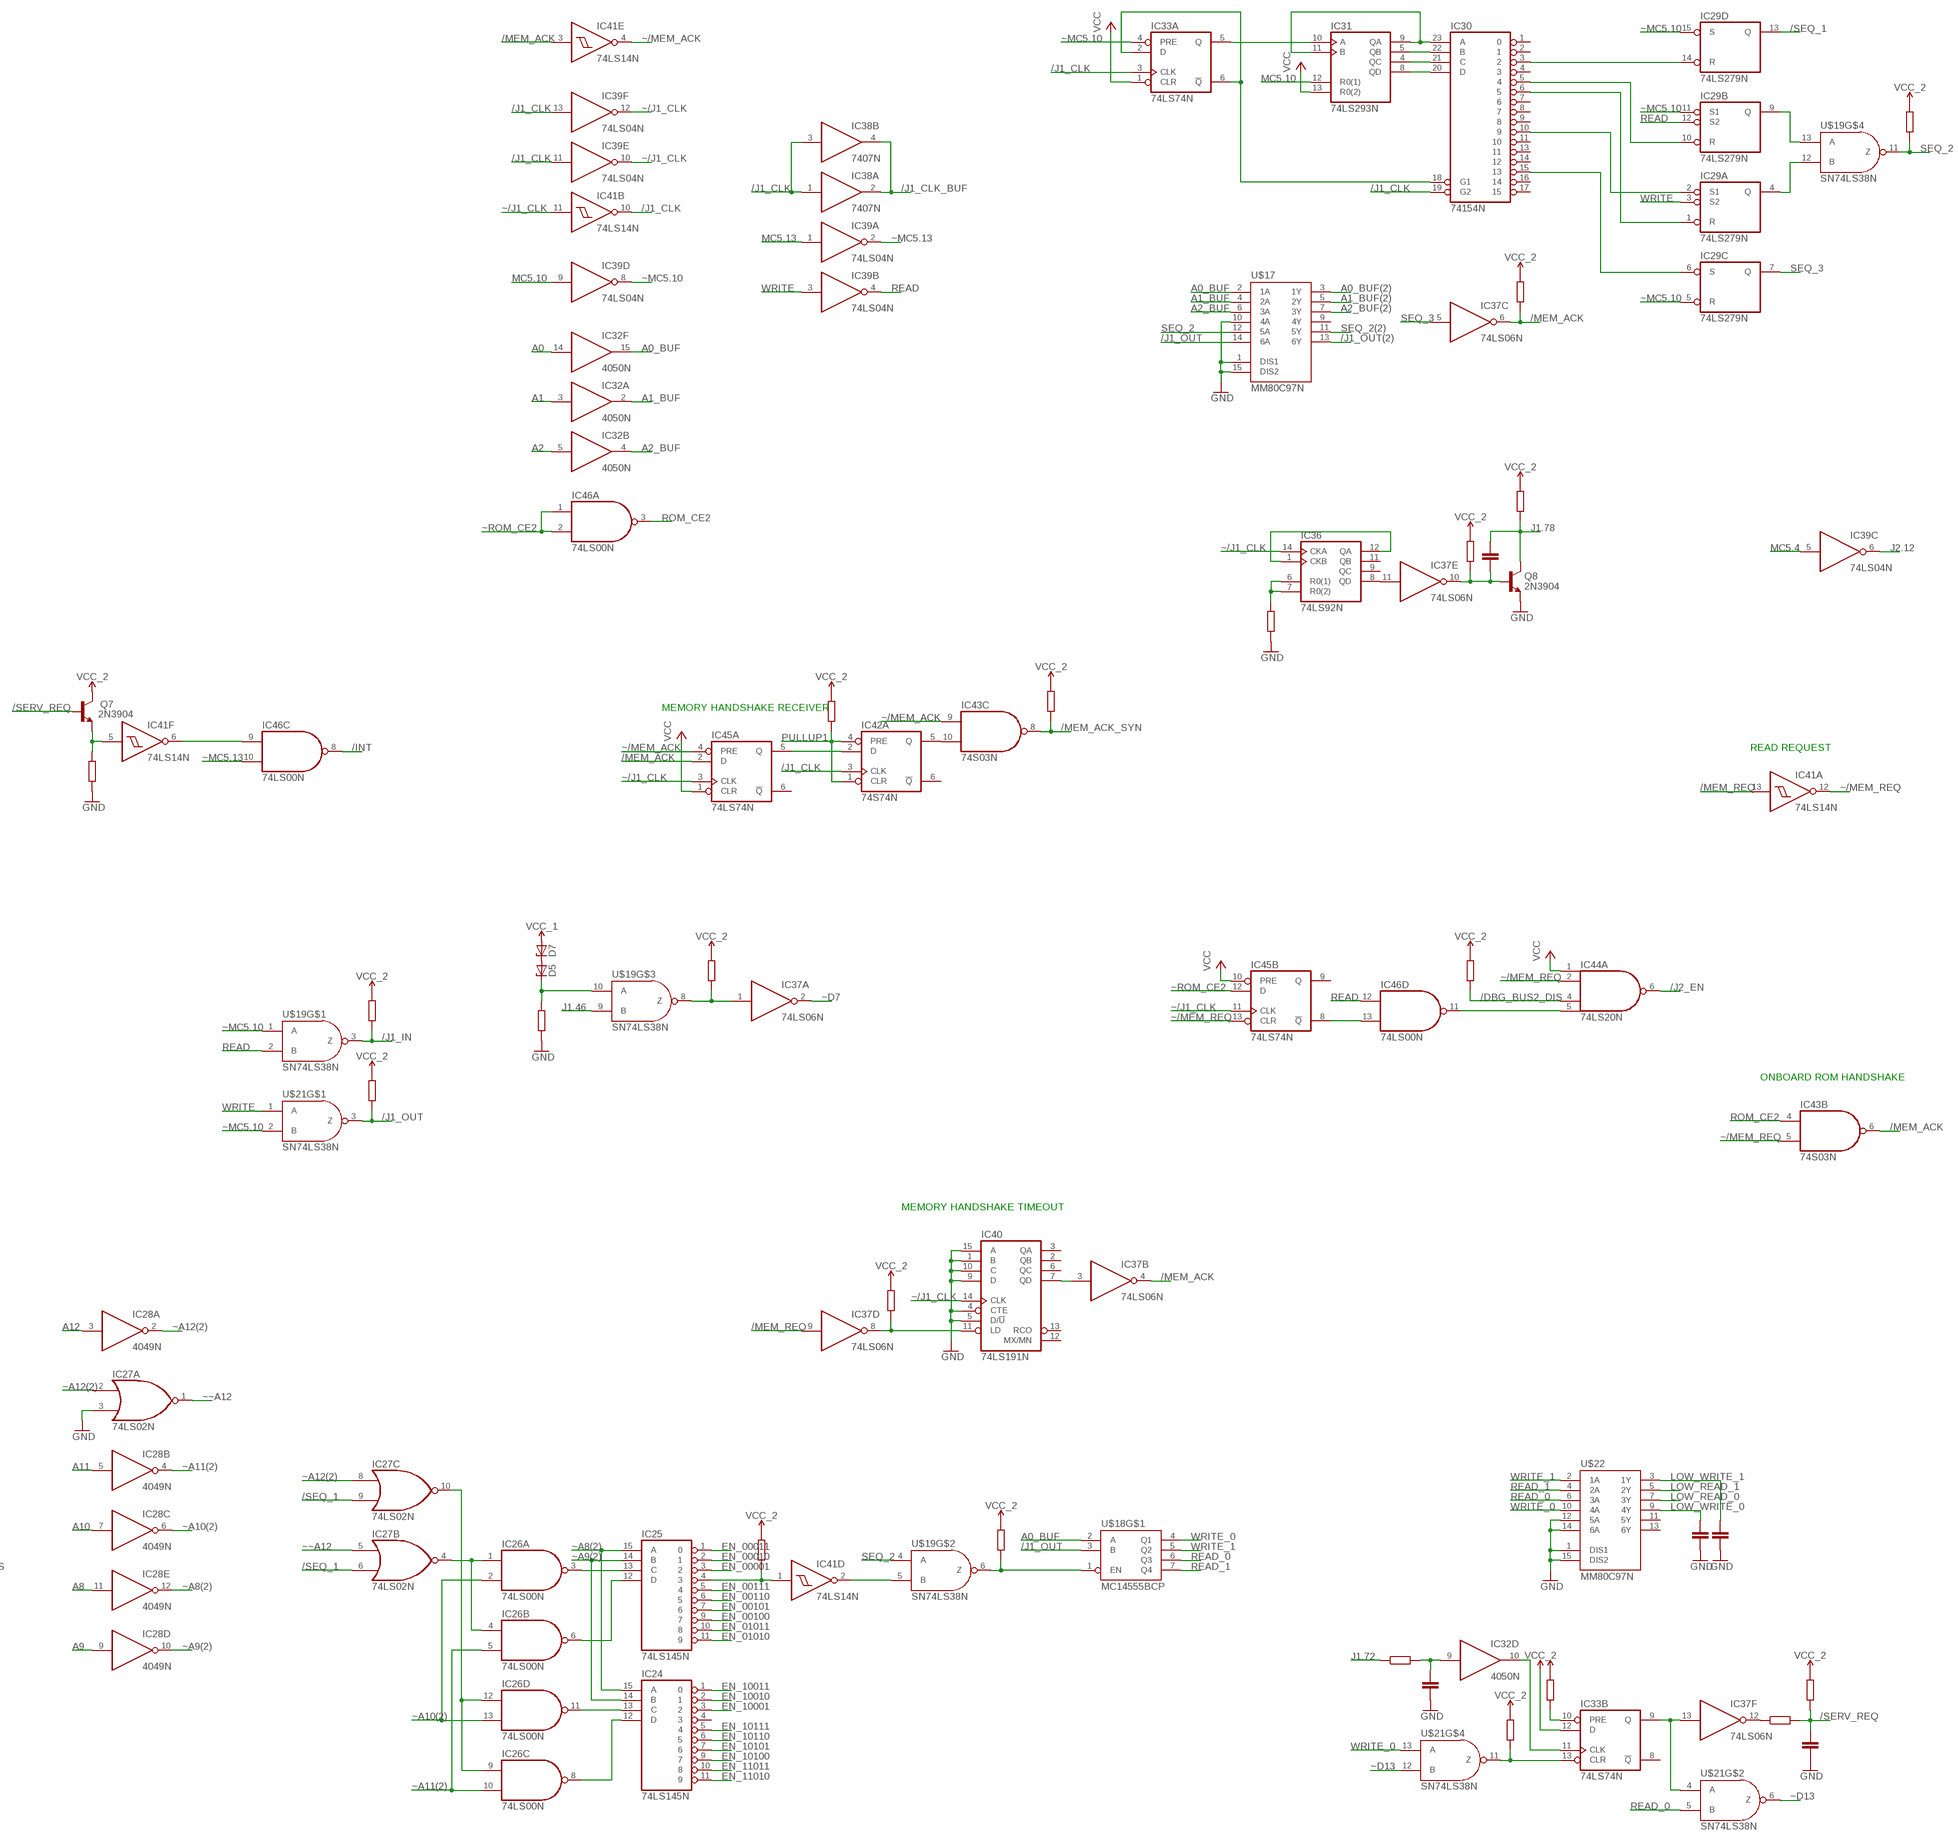
[diagram p8: schematic, sheet 2, part 2 of 3]
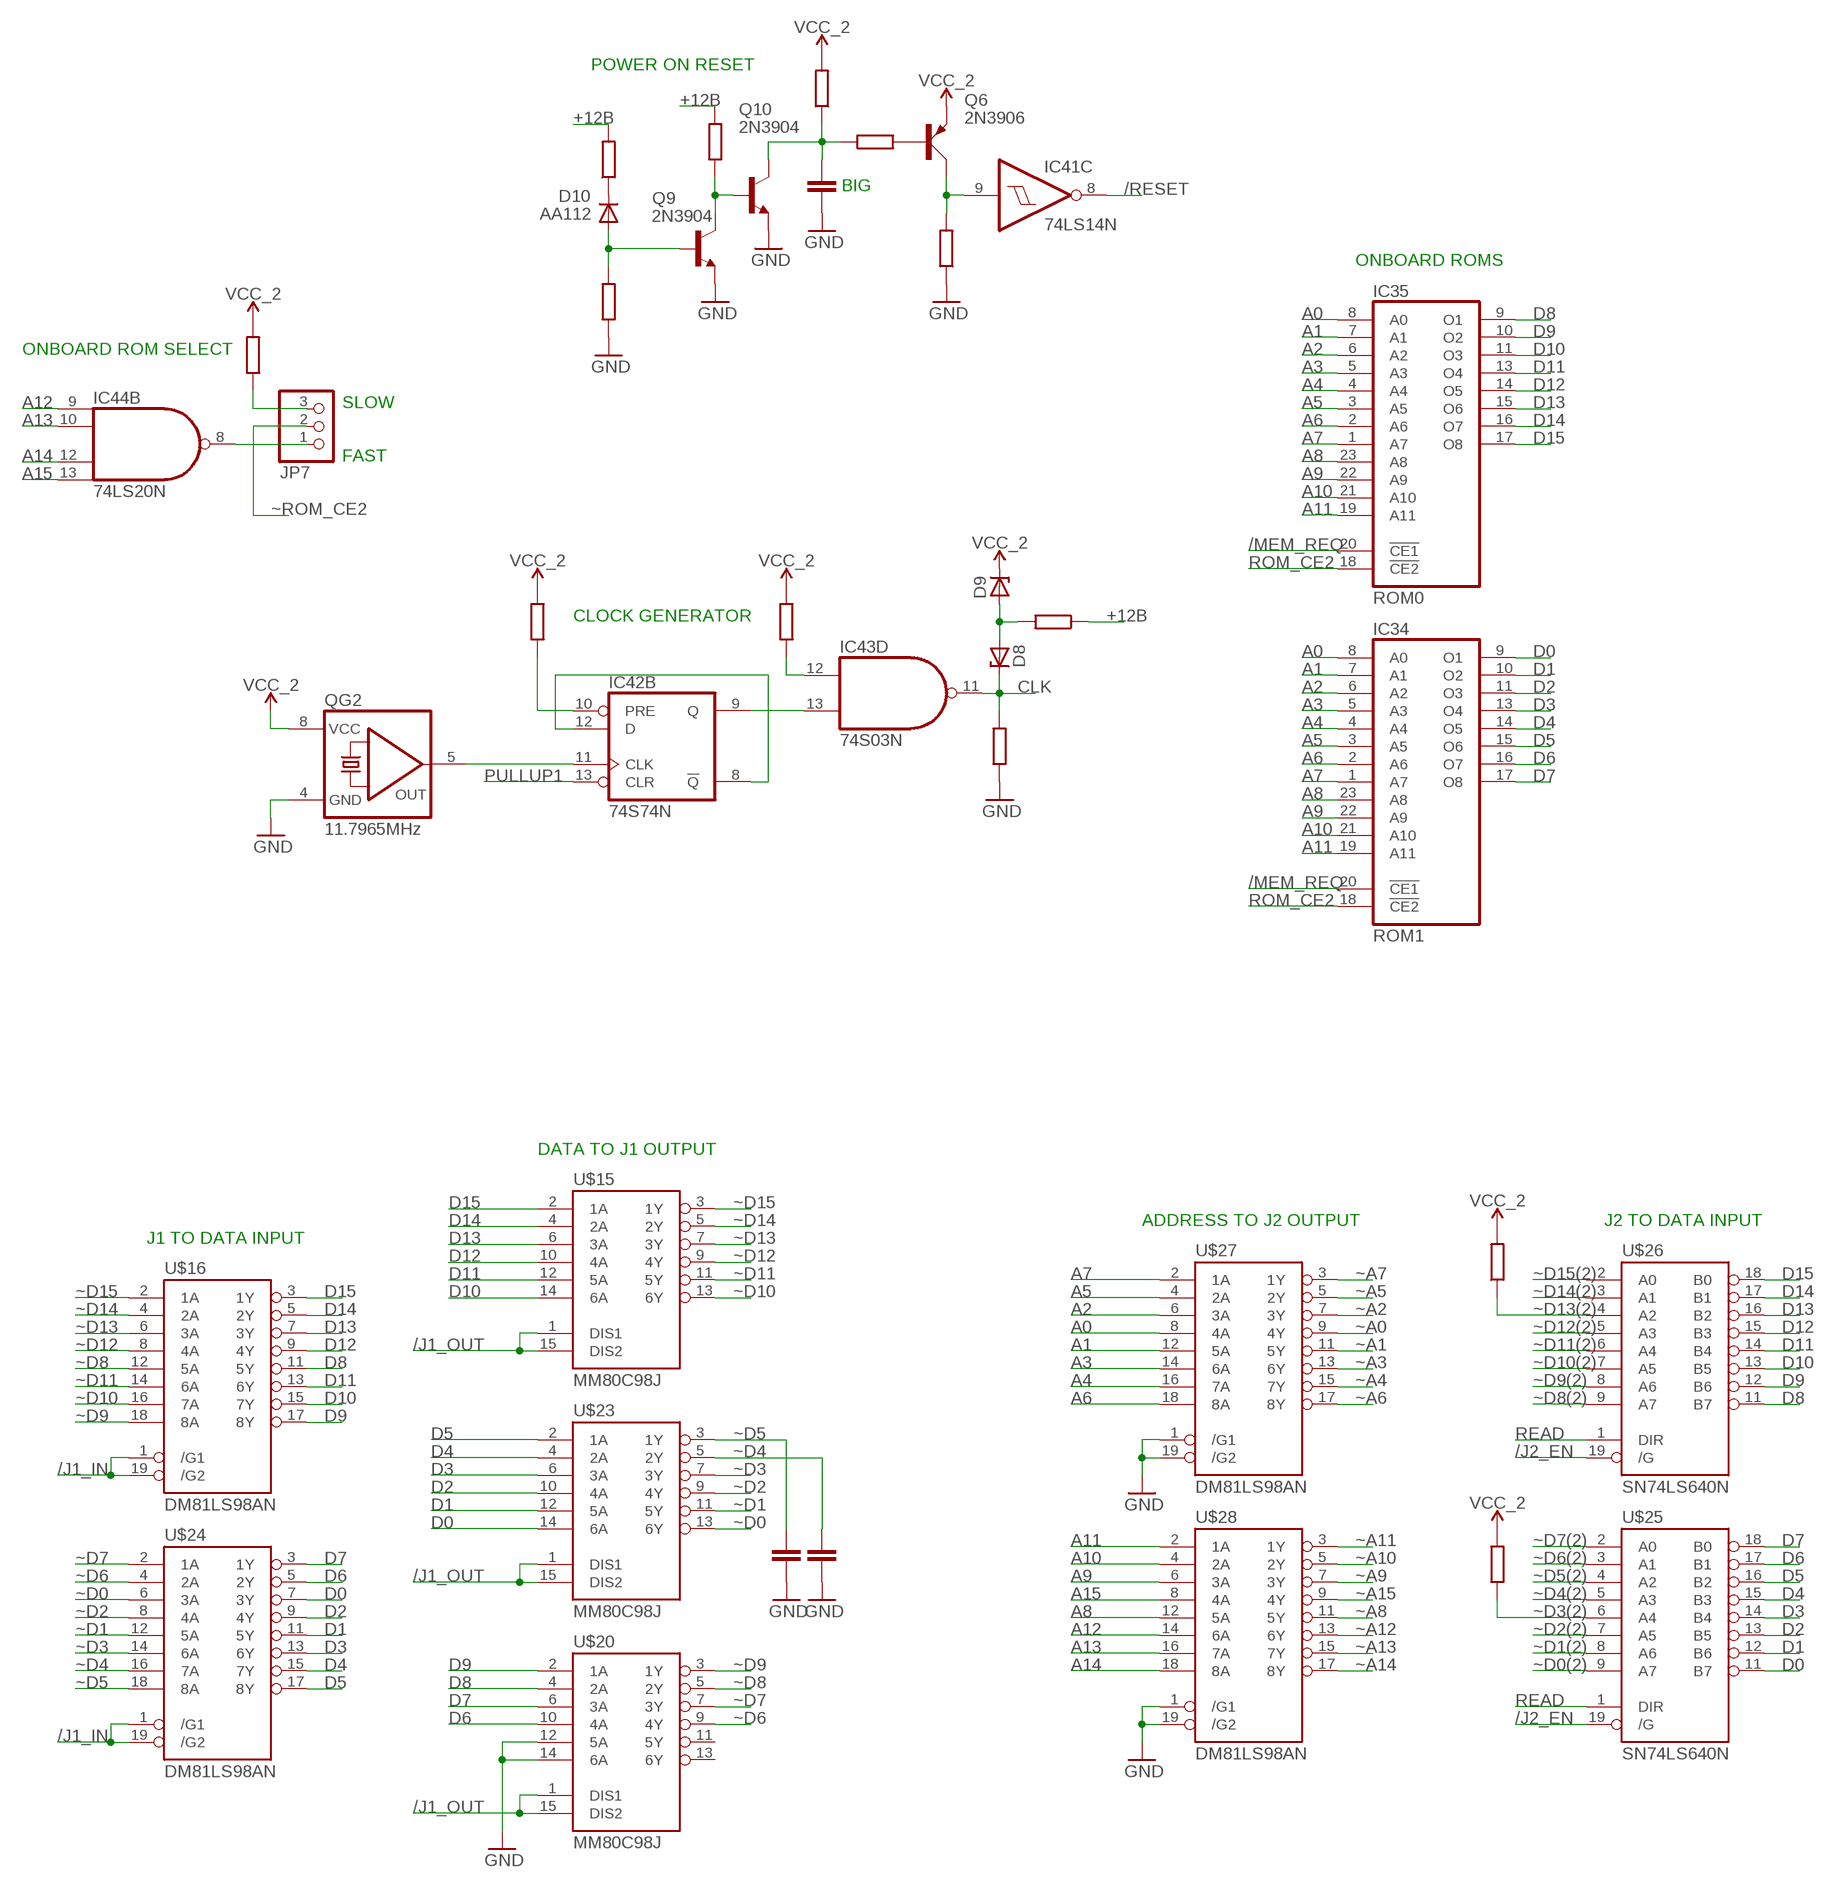
[diagram p9: schematic, sheet 2, part 3 of 3]

### Parts
D5  ZENER-DIODEC1702-15  [C1702-15]
D7  ZENER-DIODEC1702-15  [C1702-15]
D8  ZENER-DIODEC1702-15  [C1702-15]
D9  ZENER-DIODEC1702-15  [C1702-15]
D10  AA112  [DO07]
IC24  74LS145N  [DIL16]
IC25  74LS145N  [DIL16]
IC26  74LS00N  [DIL14]
IC27  74LS02N  [DIL14]
IC28  4049N  [DIL16]
IC29  74LS279N  [DIL16]
IC30  74154N  [DIL24-6]
IC31  74LS293N  [DIL14]
IC32  4050N  [DIL16]
IC33  74LS74N  [DIL14]
IC34  ROM1  7142E  [DIL24]
IC35  ROM0  7142E  [DIL24]
IC36  74LS92N  [DIL14]
IC37  74LS06N  [DIL14]
IC38  7407N  [DIL14]
IC39  74LS04N  [DIL14]
IC40  74LS191N  [DIL16]
IC41  74LS14N  [DIL14]
IC42  74S74N  [DIL14]
IC43  74S03N  [DIL14]
IC44  74LS20N  [DIL14]
IC45  74LS74N  [DIL14]
IC46  74LS00N  [DIL14]
JP6  PINHD-1X100  [1X100]
JP7  PINHD-1X3  [1X03]
JP8  PINHD-1X100  [1X100]
JP9  PINHD-1X100  [1X100]
JP10  PINHD-1X100  [1X100]
Q6  2N3906  [TO92D]
Q7  2N3904  [TO92]
Q8  2N3904  [TO92]
Q9  2N3904  [TO92]
Q10  2N3904  [TO92]
QG2  11.7965MHz  QG5460  [DIL08S]
U$15  MM80C98J  [DIL16]
U$16  DM81LS98AN  [DIL20]
U$17  MM80C97N  [DIL16]
U$18  MC14555BCP  [DIL16]
U$19  SN74LS38N  [DIL14]
U$20  MM80C98J  [DIL16]
U$21  SN74LS38N  [DIL14]
U$22  MM80C97N  [DIL16]
U$23  MM80C98J  [DIL16]
U$24  DM81LS98AN  [DIL20]
U$25  SN74LS640N  [DIL20]
U$26  SN74LS640N  [DIL20]
U$27  DM81LS98AN  [DIL20]
U$28  DM81LS98AN  [DIL20]

### Nets
+12B: D8.A D9.A JP6.14 JP8.41 JP8.42 ; also sheet 1
/DBG_BUS2_DIS: IC44.4(A:I2) JP10.49
/INT: IC46.8(C:O) JP6.6
/J1_CLK: IC30.19(G2) IC33.3(A:CLK) IC38.1(A:I) IC38.3(B:I) IC39.11(E:I) IC39.13(F:I) IC41.10(B:O) IC42.3(A:CLK) JP6.9 JP10.36
/J1_CLK_BUF: IC38.2(A:O) IC38.4(B:O) JP8.83
/J1_IN: U$16.1(/G1) U$16.19(/G2) U$19.3(Z) U$24.1(/G1) U$24.19(/G2)
/J1_OUT: U$15.1(DIS1) U$15.15(DIS2) U$17.14(6A) U$18.3(B) U$20.1(DIS1) U$20.15(DIS2) U$21.3(Z) U$23.1(DIS1) U$23.15(DIS2)
/J1_OUT(2): JP8.56 U$17.13(6Y)
/J2_EN: IC44.6(A:O) U$25.19(/G) U$26.19(/G)
/MEM_ACK: IC37.4(B:O) IC37.6(C:O) IC41.3(E:I) IC43.6(B:O) IC45.2(A:D) JP9.4 JP10.2
/MEM_ACK_SYN: IC43.8(C:O) JP6.11
/MEM_REQ: IC34.20(!CE1) IC35.20(!CE1) IC37.9(D:I) IC41.13(A:I) JP6.12 JP10.17
/RESET: IC41.8(C:O) JP6.3 JP10.4
/SEQ_1: IC27.6(B:I1) IC27.9(C:I1) IC29.13(D:Q)
/SERV_REQ: JP8.66 Q7.2(B)
A0: IC32.14(F:I) IC34.8(A0) IC35.8(A0) JP6.15 JP10.39 U$27.8(4A) ; also sheet 1
A0_BUF: IC32.15(F:O) U$17.2(1A) U$18.2(A)
A0_BUF(2): JP8.52 U$17.3(1Y)
A1: IC32.3(A:I) IC34.7(A1) IC35.7(A1) JP6.16 JP10.41 U$27.12(5A) ; also sheet 1
A1_BUF: IC32.2(A:O) U$17.4(2A)
A1_BUF(2): JP8.50 U$17.5(2Y)
A2: IC32.5(B:I) IC34.6(A2) IC35.6(A2) JP6.17 JP10.43 U$27.6(3A) ; also sheet 1
A2_BUF: IC32.4(B:O) U$17.6(3A)
A2_BUF(2): JP8.48 U$17.7(3Y)
A3: IC34.5(A3) IC35.5(A3) JP6.18 JP10.50 U$27.14(6A) ; also sheet 1
A4: IC34.4(A4) IC35.4(A4) JP6.19 JP10.33 U$27.16(7A) ; also sheet 1
A5: IC34.3(A5) IC35.3(A5) JP6.20 JP10.35 U$27.4(2A) ; also sheet 1
A6: IC34.2(A6) IC35.2(A6) JP6.21 JP10.37 U$27.18(8A) ; also sheet 1
A7: IC34.1(A7) IC35.1(A7) JP6.22 JP10.48 U$27.2(1A) ; also sheet 1
A8: IC28.11(E:I) IC34.23(A8) IC35.23(A8) JP6.23 JP10.27 U$28.12(5A) ; also sheet 1
A9: IC28.9(D:I) IC34.22(A9) IC35.22(A9) JP6.24 JP10.29 U$28.6(3A) ; also sheet 1
A10: IC28.7(C:I) IC34.21(A10) IC35.21(A10) JP6.25 JP10.31 U$28.4(2A) ; also sheet 1
A11: IC28.5(B:I) IC34.19(A11) IC35.19(A11) JP6.26 JP10.46 U$28.2(1A) ; also sheet 1
A12: IC28.3(A:I) IC44.9(B:I0) JP6.27 JP10.21 U$28.14(6A) ; also sheet 1
A13: IC44.10(B:I1) JP6.28 JP10.23 U$28.16(7A) ; also sheet 1
A14: IC44.12(B:I2) JP6.29 JP10.25 U$28.18(8A) ; also sheet 1
A15: IC44.13(B:I3) JP6.30 JP10.44 U$28.8(4A) ; also sheet 1
CLK: D8.C IC43.11(D:O) JP6.8
D0: IC34.9(O1) JP6.47 JP10.20 U$23.14(6A) U$24.7(3Y) U$25.11(B7)
D1: IC34.10(O2) JP6.46 JP10.11 U$23.12(5A) U$24.11(5Y) U$25.12(B6)
D2: IC34.11(O3) JP6.45 JP10.13 U$23.10(4A) U$24.9(4Y) U$25.13(B5)
D3: IC34.13(O4) JP6.44 JP10.32 U$23.6(3A) U$24.13(6Y) U$25.14(B4)
D4: IC34.14(O5) JP6.43 JP10.16 U$23.4(2A) U$24.15(7Y) U$25.15(B3)
D5: IC34.15(O6) JP6.42 JP10.7 U$23.2(1A) U$24.17(8Y) U$25.16(B2)
D6: IC34.16(O7) JP6.41 JP10.9 U$20.10(4A) U$24.5(2Y) U$25.17(B1)
D7: IC34.17(O8) JP6.40 JP10.18 U$20.6(3A) U$24.3(1Y) U$25.18(B0)
D8: IC35.9(O1) JP6.39 JP10.12 U$16.11(5Y) U$20.4(2A) U$26.11(B7)
D9: IC35.10(O2) JP6.38 JP10.3 U$16.17(8Y) U$20.2(1A) U$26.12(B6)
D10: IC35.11(O3) JP6.37 JP10.5 U$15.14(6A) U$16.15(7Y) U$26.13(B5)
D11: IC35.13(O4) JP6.36 JP10.14 U$15.12(5A) U$16.13(6Y) U$26.14(B4)
D12: IC35.14(O5) JP6.35 JP10.8 U$15.10(4A) U$16.9(4Y) U$26.15(B3)
D13: IC35.15(O6) JP6.34 JP10.6 U$15.6(3A) U$16.7(3Y) U$26.16(B2)
D14: IC35.16(O7) JP6.33 JP10.1 U$15.4(2A) U$16.5(2Y) U$26.17(B1)
D15: IC35.17(O8) JP6.32 JP10.10 U$15.2(1A) U$16.3(1Y) U$26.18(B0)
EN_00001: IC25.3 JP8.12
EN_00010: IC25.2 JP8.10
EN_00011: IC25.1 JP8.8
EN_00100: IC25.9 JP8.23
EN_00101: IC25.7 JP8.22
EN_00110: IC25.6 JP8.24
EN_00111: IC25.5 JP8.19
EN_01010: IC25.11 JP8.20
EN_01011: IC25.10 JP8.21
EN_10001: IC24.3 JP8.11
EN_10010: IC24.2 JP8.9
EN_10011: IC24.1 JP8.7
EN_10100: IC24.9 JP8.18
EN_10101: IC24.7 JP8.17
EN_10110: IC24.6 JP8.15
EN_10111: IC24.5 JP8.13
EN_11010: IC24.11 JP8.14
EN_11011: IC24.10 JP8.16
GND: IC27.3(A:I1) IC40.1(B) IC40.4(CTE) IC40.5(D/!U) IC40.9(D) IC40.10(C) IC40.15(A) JP6.1 JP8.1 JP8.84 JP8.86 JP9.1 JP9.3 JP9.5 JP9.7 JP9.9 JP9.11 JP9.13 JP9.15 JP9.16 JP9.33 JP9.34 JP10.34 JP10.38 Q8.3(E) Q9.3(E) Q10.3(E) QG2.4(GND) U$17.1(DIS1) U$17.10(4A) U$17.15(DIS2) U$20.12(5A) U$20.14(6A) U$22.1(DIS1) U$22.12(5A) U$22.14(6A) U$22.15(DIS2) U$27.1(/G1) U$27.19(/G2) U$28.1(/G1) U$28.19(/G2) ; also sheet 1
J1.46: JP8.46 U$19.9(B) ; also sheet 1
J1.72: JP8.72 ; also sheet 1
J1.78: JP8.78 Q8.1(C) ; also sheet 1
J2.12: IC39.6(C:O) JP9.12 ; also sheet 1
LOW_READ_0: JP8.58 U$22.7(3Y)
LOW_READ_1: JP8.60 U$22.5(2Y)
LOW_WRITE_0: JP8.62 U$22.9(4Y)
LOW_WRITE_1: JP8.64 U$22.3(1Y)
MC5.4: IC39.5(C:I) JP6.4 JP10.24
MC5.7: JP6.7 JP9.10 JP10.26
MC5.10: IC31.12(R0(1)) IC39.9(D:I) JP6.10
MC5.13: IC39.1(A:I) JP6.13 JP10.22
N$19: IC26.1(A:I0) IC26.4(B:I0) IC27.4(B:O)
N$30: IC44.5(A:I3) IC46.11(D:O)
N$68: IC33.9(B:Q) IC37.13(F:I) U$21.4(A)
N$93: IC26.9(C:I0) IC26.12(D:I0) IC27.10(C:O)
N$101: IC25.13(C) IC26.3(A:O)
N$103: IC33.10(B:PRE)
N$104: IC30.23(A) IC31.9(QA) IC31.11(B)
N$105: U$18.1(EN) U$19.6(Z)
N$106: D5.C U$19.10(A)
N$107: IC42.10(B:PRE)
N$108: IC42.8(B:!Q) IC42.12(B:D)
N$111: IC32.9(D:I)
N$112: IC37.10(E:O) Q8.2(B)
N$116: IC24.12(D) IC26.8(C:O)
N$117: IC24.13(C) IC26.11(D:O)
N$118: IC25.12(D) IC26.6(B:O)
N$119: IC25.4 IC41.1(D:I)
N$124: IC30.21(C) IC31.4(QC)
N$125: IC30.22(B) IC31.5(QB)
N$126: IC30.20(D) IC31.8(QD)
N$128: IC31.10(A) IC33.5(A:Q)
N$129: IC29.14(D:R) IC30.3
N$130: IC29.10(B:R) IC30.5
N$131: IC29.1(A:R) IC30.6
N$132: IC29.2(A:S1) IC30.10
N$133: IC29.6(C:S) IC30.15
N$135: IC30.18(G1) IC33.2(A:D) IC33.6(A:!Q)
N$137: IC29.4(A:Q) U$19.12(B)
N$139: IC41.2(D:O) U$19.5(B)
N$141: IC37.1(A:I) U$19.8(Z)
N$142: D5.A D7.C
N$144: IC29.9(B:Q) U$19.13(A)
N$153: IC32.10(D:O) IC33.11(B:CLK)
N$154: IC33.13(B:CLR) U$21.11(Z)
N$157: IC41.5(F:I) Q7.3(E)
N$158: IC37.3(B:I) IC40.7(QD)
N$159: IC37.8(D:O) IC40.11(LD)
N$160: IC36.8(QD) IC37.11(E:I)
N$161: IC36.6(R0(1)) IC36.7(R0(2))
N$163: IC36.1(CKB) IC36.12(QA)
N$165: IC41.6(F:O) IC46.9(C:I0)
N$167: IC41.9(C:I) Q6.C
N$173: IC43.12(D:I0)
N$174: IC42.5(A:Q) IC43.10(C:I1)
N$175: IC42.9(B:Q) IC43.13(D:I1)
N$176: IC42.2(A:D) IC45.5(A:Q)
N$178: IC42.11(B:CLK) QG2.5(OUT)
N$181: Q10.1(C)
N$182: Q9.1(C) Q10.2(B)
N$183: D10.A Q9.2(B)
N$184: IC44.8(B:O) JP7.1
N$185: JP7.3
N$187: IC45.8(B:!Q) IC46.13(D:I1)
N$189: JP6.5
PULLUP1: IC42.1(A:CLR) IC42.4(A:PRE) IC42.13(B:CLR)
READ: IC29.12(B:S2) IC39.4(B:O) IC46.12(D:I0) JP9.6 U$19.2(B) U$25.1(DIR) U$26.1(DIR)
READ_0: U$18.6(Q3) U$21.5(B) U$22.6(3A)
READ_1: U$18.7(Q4) U$22.4(2A)
ROM_CE2: IC34.18(!CE2) IC35.18(!CE2) IC43.4(B:I0) IC46.3(A:O) ; also sheet 1
SEQ_2: U$17.12(5A) U$19.4(A) U$19.11(Z)
SEQ_2(2): JP8.54 U$17.11(5Y)
SEQ_3: IC29.7(C:Q) IC37.5(C:I) JP10.19
VCC: IC31.13(R0(2)) IC33.1(A:CLR) IC44.1(A:I0) IC45.1(A:CLR) IC45.10(B:PRE) ; also sheet 1
VCC_1: D7.A JP8.2 JP8.3 JP8.4 JP8.85 ; also sheet 1
VCC_2: D9.C IC33.12(B:D) JP6.2 JP6.31 JP8.43 JP8.44 Q6.E Q7.1(C) QG2.8(VCC) ; also sheet 1
WRITE: IC29.3(A:S2) IC39.3(B:I) JP6.48 JP10.15 U$21.1(A)
WRITE_0: U$18.4(Q1) U$21.13(A) U$22.10(4A)
WRITE_1: U$18.5(Q2) U$22.2(1A)
~/J1_CLK: IC36.14(CKA) IC39.10(E:O) IC39.12(F:O) IC40.14(CLK) IC41.11(B:I) IC45.3(A:CLK) IC45.11(B:CLK)
~/MEM_ACK: IC41.4(E:O) IC43.9(C:I0) IC45.4(A:PRE)
~/MEM_REQ: IC41.12(A:O) IC43.5(B:I1) IC44.2(A:I1) IC45.13(B:CLR) JP9.2
~A0: JP9.50 U$27.9(4Y)
~A1: JP9.49 U$27.11(5Y)
~A2: JP9.48 U$27.7(3Y)
~A3: JP9.47 U$27.13(6Y)
~A4: JP9.46 U$27.15(7Y)
~A5: JP9.45 U$27.5(2Y)
~A6: JP9.44 U$27.17(8Y)
~A7: JP9.43 U$27.3(1Y)
~A8: JP9.42 U$28.11(5Y)
~A8(2): IC24.15(A) IC25.15(A) IC28.12(E:O)
~A9: JP9.41 U$28.7(3Y)
~A9(2): IC24.14(B) IC25.14(B) IC28.10(D:O)
~A10: JP9.40 U$28.5(2Y)
~A10(2): IC26.2(A:I1) IC26.13(D:I1) IC28.6(C:O)
~A11: JP9.39 U$28.3(1Y)
~A11(2): IC26.5(B:I1) IC26.10(C:I1) IC28.4(B:O)
~A12: JP9.38 U$28.13(6Y)
~A12(2): IC27.2(A:I0) IC27.8(C:I0) IC28.2(A:O)
~A13: JP9.37 U$28.15(7Y)
~A14: JP9.36 U$28.17(8Y)
~A15: JP9.35 U$28.9(4Y)
~D0: JP8.75 U$23.13(6Y) U$24.6(3A)
~D0(2): JP9.32 U$25.9(A7)
~D1: JP8.73 U$23.11(5Y) U$24.12(5A)
~D1(2): JP9.31 U$25.8(A6)
~D2: JP8.71 U$23.9(4Y) U$24.8(4A)
~D2(2): JP9.30 U$25.7(A5)
~D3: JP8.69 U$23.7(3Y) U$24.14(6A)
~D3(2): JP9.29 U$25.6(A4)
~D4: JP8.67 U$23.5(2Y) U$24.16(7A)
~D4(2): JP9.28 U$25.5(A3)
~D5: JP8.65 U$23.3(1Y) U$24.18(8A)
~D5(2): JP9.27 U$25.4(A2)
~D6: JP8.63 U$20.9(4Y) U$24.4(2A)
~D6(2): JP9.26 U$25.3(A1)
~D7: IC37.2(A:O) JP8.61 U$20.7(3Y) U$24.2(1A)
~D7(2): JP9.25 U$25.2(A0)
~D8: JP8.59 U$16.12(5A) U$20.5(2Y)
~D8(2): JP9.24 U$26.9(A7)
~D9: JP8.57 U$16.18(8A) U$20.3(1Y)
~D9(2): JP9.23 U$26.8(A6)
~D10: JP8.55 U$15.13(6Y) U$16.16(7A)
~D10(2): JP9.22 U$26.7(A5)
~D11: JP8.53 U$15.11(5Y) U$16.14(6A)
~D11(2): JP9.21 U$26.6(A4)
~D12: JP8.51 U$15.9(4Y) U$16.8(4A)
~D12(2): JP9.20 U$26.5(A3)
~D13: JP8.49 U$15.7(3Y) U$16.6(3A) U$21.6(Z) U$21.12(B)
~D13(2): JP9.19 U$26.4(A2)
~D14: JP8.47 U$15.5(2Y) U$16.4(2A)
~D14(2): JP9.18 U$26.3(A1)
~D15: JP8.45 U$15.3(1Y) U$16.2(1A)
~D15(2): JP9.17 U$26.2(A0)
~MC5.10: IC29.5(C:R) IC29.11(B:S1) IC29.15(D:S) IC33.4(A:PRE) IC39.8(D:O) U$19.1(A) U$21.2(B)
~MC5.13: IC39.2(A:O) IC46.10(C:I1) JP9.8
~ROM_CE2: IC45.12(B:D) IC46.1(A:I0) IC46.2(A:I1) JP7.2
~~A12: IC27.1(A:O) IC27.5(B:I0)
Unconnected: D10.C IC24.4 IC27.11(D:I0) IC27.12(D:I1) IC27.13(D:O) IC28.14(F:I) IC28.15(F:O) IC30.1 IC30.2 IC30.4 IC30.7 IC30.8 IC30.9 IC30.11 IC30.13 IC30.14 IC30.16 IC30.17 IC32.6(C:O) IC32.7(C:I) IC32.11(E:I) IC32.12(E:O) IC33.8(B:!Q) IC36.9(QC) IC36.11(QB) IC37.12(F:O) IC38.5(C:I) IC38.6(C:O) IC38.8(D:O) IC38.9(D:I) IC38.10(E:O) IC38.11(E:I) IC38.12(F:O) IC38.13(F:I) IC40.2(QB) IC40.3(QA) IC40.6(QC) IC40.12(MX/MN) IC40.13(RCO) IC42.6(A:!Q) IC43.1(A:I0) IC43.2(A:I1) IC43.3(A:O) IC45.6(A:!Q) IC45.9(B:Q) IC46.4(B:I0) IC46.5(B:I1) IC46.6(B:O) JP6.49 JP6.50 JP6.51 JP6.52 JP6.53 JP6.54 JP6.55 JP6.56 JP6.57 JP6.58 JP6.59 JP6.60 JP6.61 JP6.62 JP6.63 JP6.64 JP6.65 JP6.66 JP6.67 JP6.68 JP6.69 JP6.70 JP6.71 JP6.72 JP6.73 JP6.74 JP6.75 JP6.76 JP6.77 JP6.78 JP6.79 JP6.80 JP6.81 JP6.82 JP6.83 JP6.84 JP6.85 JP6.86 JP6.87 JP6.88 JP6.89 JP6.90 JP6.91 JP6.92 JP6.93 JP6.94 JP6.95 JP6.96 JP6.97 JP6.98 JP6.99 JP6.100 JP8.5 JP8.6 JP8.25 JP8.26 JP8.27 JP8.28 JP8.29 JP8.30 JP8.31 JP8.32 JP8.33 JP8.34 JP8.35 JP8.36 JP8.37 JP8.38 JP8.39 JP8.40 JP8.68 JP8.70 JP8.74 JP8.76 JP8.77 JP8.79 JP8.80 JP8.81 JP8.82 JP8.87 JP8.88 JP8.89 JP8.90 JP8.91 JP8.92 JP8.93 JP8.94 JP8.95 JP8.96 JP8.97 JP8.98 JP8.99 JP8.100 JP9.14 JP9.51 JP9.52 JP9.53 JP9.54 JP9.55 JP9.56 JP9.57 JP9.58 JP9.59 JP9.60 JP9.61 JP9.62 JP9.63 JP9.64 JP9.65 JP9.66 JP9.67 JP9.68 JP9.69 JP9.70 JP9.71 JP9.72 JP9.73 JP9.74 JP9.75 JP9.76 JP9.77 JP9.78 JP9.79 JP9.80 JP9.81 JP9.82 JP9.83 JP9.84 JP9.85 JP9.86 JP9.87 JP9.88 JP9.89 JP9.90 JP9.91 JP9.92 JP9.93 JP9.94 JP9.95 JP9.96 JP9.97 JP9.98 JP9.99 JP9.100 JP10.28 JP10.30 JP10.40 JP10.42 JP10.45 JP10.47 JP10.51 JP10.52 JP10.53 JP10.54 JP10.55 JP10.56 JP10.57 JP10.58 JP10.59 JP10.60 JP10.61 JP10.62 JP10.63 JP10.64 JP10.65 JP10.66 JP10.67 JP10.68 JP10.69 JP10.70 JP10.71 JP10.72 JP10.73 JP10.74 JP10.75 JP10.76 JP10.77 JP10.78 JP10.79 JP10.80 JP10.81 JP10.82 JP10.83 JP10.84 JP10.85 JP10.86 JP10.87 JP10.88 JP10.89 JP10.90 JP10.91 JP10.92 JP10.93 JP10.94 JP10.95 JP10.96 JP10.97 JP10.98 JP10.99 JP10.100 Q6.B U$17.9(4Y) U$18.9(Q4) U$18.10(Q3) U$18.11(Q2) U$18.12(Q1) U$18.13(B) U$18.14(A) U$18.15(EN) U$20.11(5Y) U$20.13(6Y) U$21.8(Z) U$21.9(B) U$21.10(A) U$22.11(5Y) U$22.13(6Y)

### Notes on the sheet
- MEMORY HANDSHAKE RECEIVER
- READ REQUEST
- ONBOARD ROM HANDSHAKE
- POWER ON RESET
- BIG
- ONBOARD ROMS
- MEMORY HANDSHAKE TIMEOUT
- ONBOARD ROM SELECT
- SLOW
- FAST
- CLOCK GENERATOR
- DATA TO J1 OUTPUT
- ADDRESS TO J2 OUTPUT | J2 TO DATA INPUT
- J1 TO DATA INPUT

## Power pins joined to a net without a drawn wire
GND: IC1.8(GND) IC2.8(GND) IC3.7(P:GND) IC4.7(P:GND) IC6.8(P:GND) IC7.12(GND) IC8.7(GND) IC10.7(P:GND) IC11.12(GND) IC12.12(GND) IC13.10(GND) IC14.7(P:GND) IC15.7(P:GND) IC16.7(P:GND) IC17.8(GND) IC18.7(P:GND) IC19.7(P:GND) IC20.7(P:GND) IC21.7(P:GND) IC22.7(P:GND) IC23.7(P:GND) IC24.8(GND) IC25.8(GND) IC26.7(P:GND) IC27.7(P:GND) IC29.8(P:GND) IC30.12(GND) IC31.7(GND) IC33.7(P:GND) IC34.12(GND) IC35.12(GND) IC36.10(GND) IC37.7(P:GND) IC38.7(P:GND) IC39.7(P:GND) IC40.8(GND) IC41.7(P:GND) IC42.7(P:GND) IC43.7(P:GND) IC44.7(P:GND) IC45.7(P:GND) IC46.7(P:GND)
VCC: IC1.16(VCC) IC2.16(VCC) IC3.14(P:VCC) IC4.14(P:VCC) IC6.16(P:VCC) IC7.24(VCC) IC8.14(VCC) IC10.14(P:VCC) IC11.24(VCC) IC12.24(VCC) IC13.5(VCC) IC14.14(P:VCC) IC15.14(P:VCC) IC16.14(P:VCC) IC17.16(VCC) IC18.14(P:VCC) IC19.14(P:VCC) IC20.14(P:VCC) IC21.14(P:VCC) IC22.14(P:VCC) IC23.14(P:VCC) IC24.16(VCC) IC25.16(VCC) IC26.14(P:VCC) IC27.14(P:VCC) IC29.16(P:VCC) IC30.24(VCC) IC31.14(VCC) IC33.14(P:VCC) IC34.24(VCC) IC35.24(VCC) IC36.5(VCC) IC37.14(P:VCC) IC38.14(P:VCC) IC39.14(P:VCC) IC40.16(VCC) IC41.14(P:VCC) IC42.14(P:VCC) IC43.14(P:VCC) IC44.14(P:VCC) IC45.14(P:VCC) IC46.14(P:VCC)
VDD: IC5.1(P:VDD) IC9.1(P:VDD) IC28.1(P:VDD) IC32.1(P:VDD)
VSS: IC5.8(P:VSS) IC9.8(P:VSS) IC28.8(P:VSS) IC32.8(P:VSS)

## Library data of the parts
D1-D5 D7-D9 = diode:ZENER-DIODE: Z-Diode
D6 D10 = diode:AA112: DIODE germanium
IC1 IC2 IC24 IC25 = 74xx-us:74*145: BCD to decimal DECODER/DRIVER
IC3 IC23 IC26 IC46 = 74xx-us:74*00: Quad 2-input NAND gate
IC4 IC27 = 74xx-us:74*02: Quad 2-input NOR gate
IC5 IC28 = 40xx:4049: Hex inverting BUFFER
IC6 IC29 = 74xx-us:74*279: Quadruple S-R LATCH
IC7 IC30 = 74xx-us:74*154: 4-line to 16-line data SELECTOR/MULTIPLEXER
IC8 IC31 = 74xx-us:74*293: Decade and 4-bit BINARY COUNTER
IC9 IC32 = 40xx:4050: Hex non-inverting BUFFER
IC10 IC19 IC22 IC33 IC42 IC45 = 74xx-us:74*74: Dual D type positive edge triggered FLIP FLOP, preset and clear
IC11 IC12 IC34 IC35 = memory:7142E: MEMORY
IC13 IC36 = 74xx-us:74*92: Decade, divide by twelve and binary COUNTER
IC14 IC37 = 74xx-us:74*06: Hex INVERTER, open collector high-voltage output
IC15 IC38 = 74xx-us:74*07: Hex BUFFER, open collector high-voltage output
IC16 IC39 = 74xx-us:74*04: Hex INVERTER
IC17 IC40 = 74xx-us:74*191: Synchronous UP/DOWN COUNTER
IC18 IC41 = 74xx-us:74*14: Hex schmitt trigger INVERTER
IC20 IC43 = 74xx-us:74*03: Quad 2-input NAND gate, open collector output
IC21 IC44 = 74xx-us:74*20: Dual 4-input NAND gate
JP1 JP3-JP6 JP8-JP10 = pinhead:PINHD-1X100: PIN HEADER 100 pol. Grid 2.54mm
JP2 JP7 = pinhead:PINHD-1X3: PIN HEADER
Q1-Q6 = transistor-small-signal:2N3906: PNP TRANSISTOR
Q7-Q10 = transistor-npn:2N3904: NPN Transistor
QG1 QG2 = crystal:QG5460: CRYSTAL RESONATOR; OC_FARNELL: unknown; OC_NEWARK: unknown
U$1 U$6 U$9 U$15 U$20 U$23 = User-Submitted:MM80C98J
U$2 U$10 U$13 U$14 U$16 U$24 U$27 U$28 = User-Submitted:DM81LS98AN
U$3 U$8 U$17 U$22 = User-Submitted:MM80C97N
U$4 U$18 = User-Submitted:MC14555BCP
U$5 U$7 U$19 U$21 = User-Submitted:SN74LS38N
U$11 U$12 U$25 U$26 = User-Submitted:SN74LS640N